# Altium project BEE-1012 PAY-EXP_V12.PrjPcb (part 2 of 4)

## Sheet 08_SAMA7G54-PMIC.SchDoc
size 420 x 297 mm; SheetNumber: 14; SheetTotal: 35
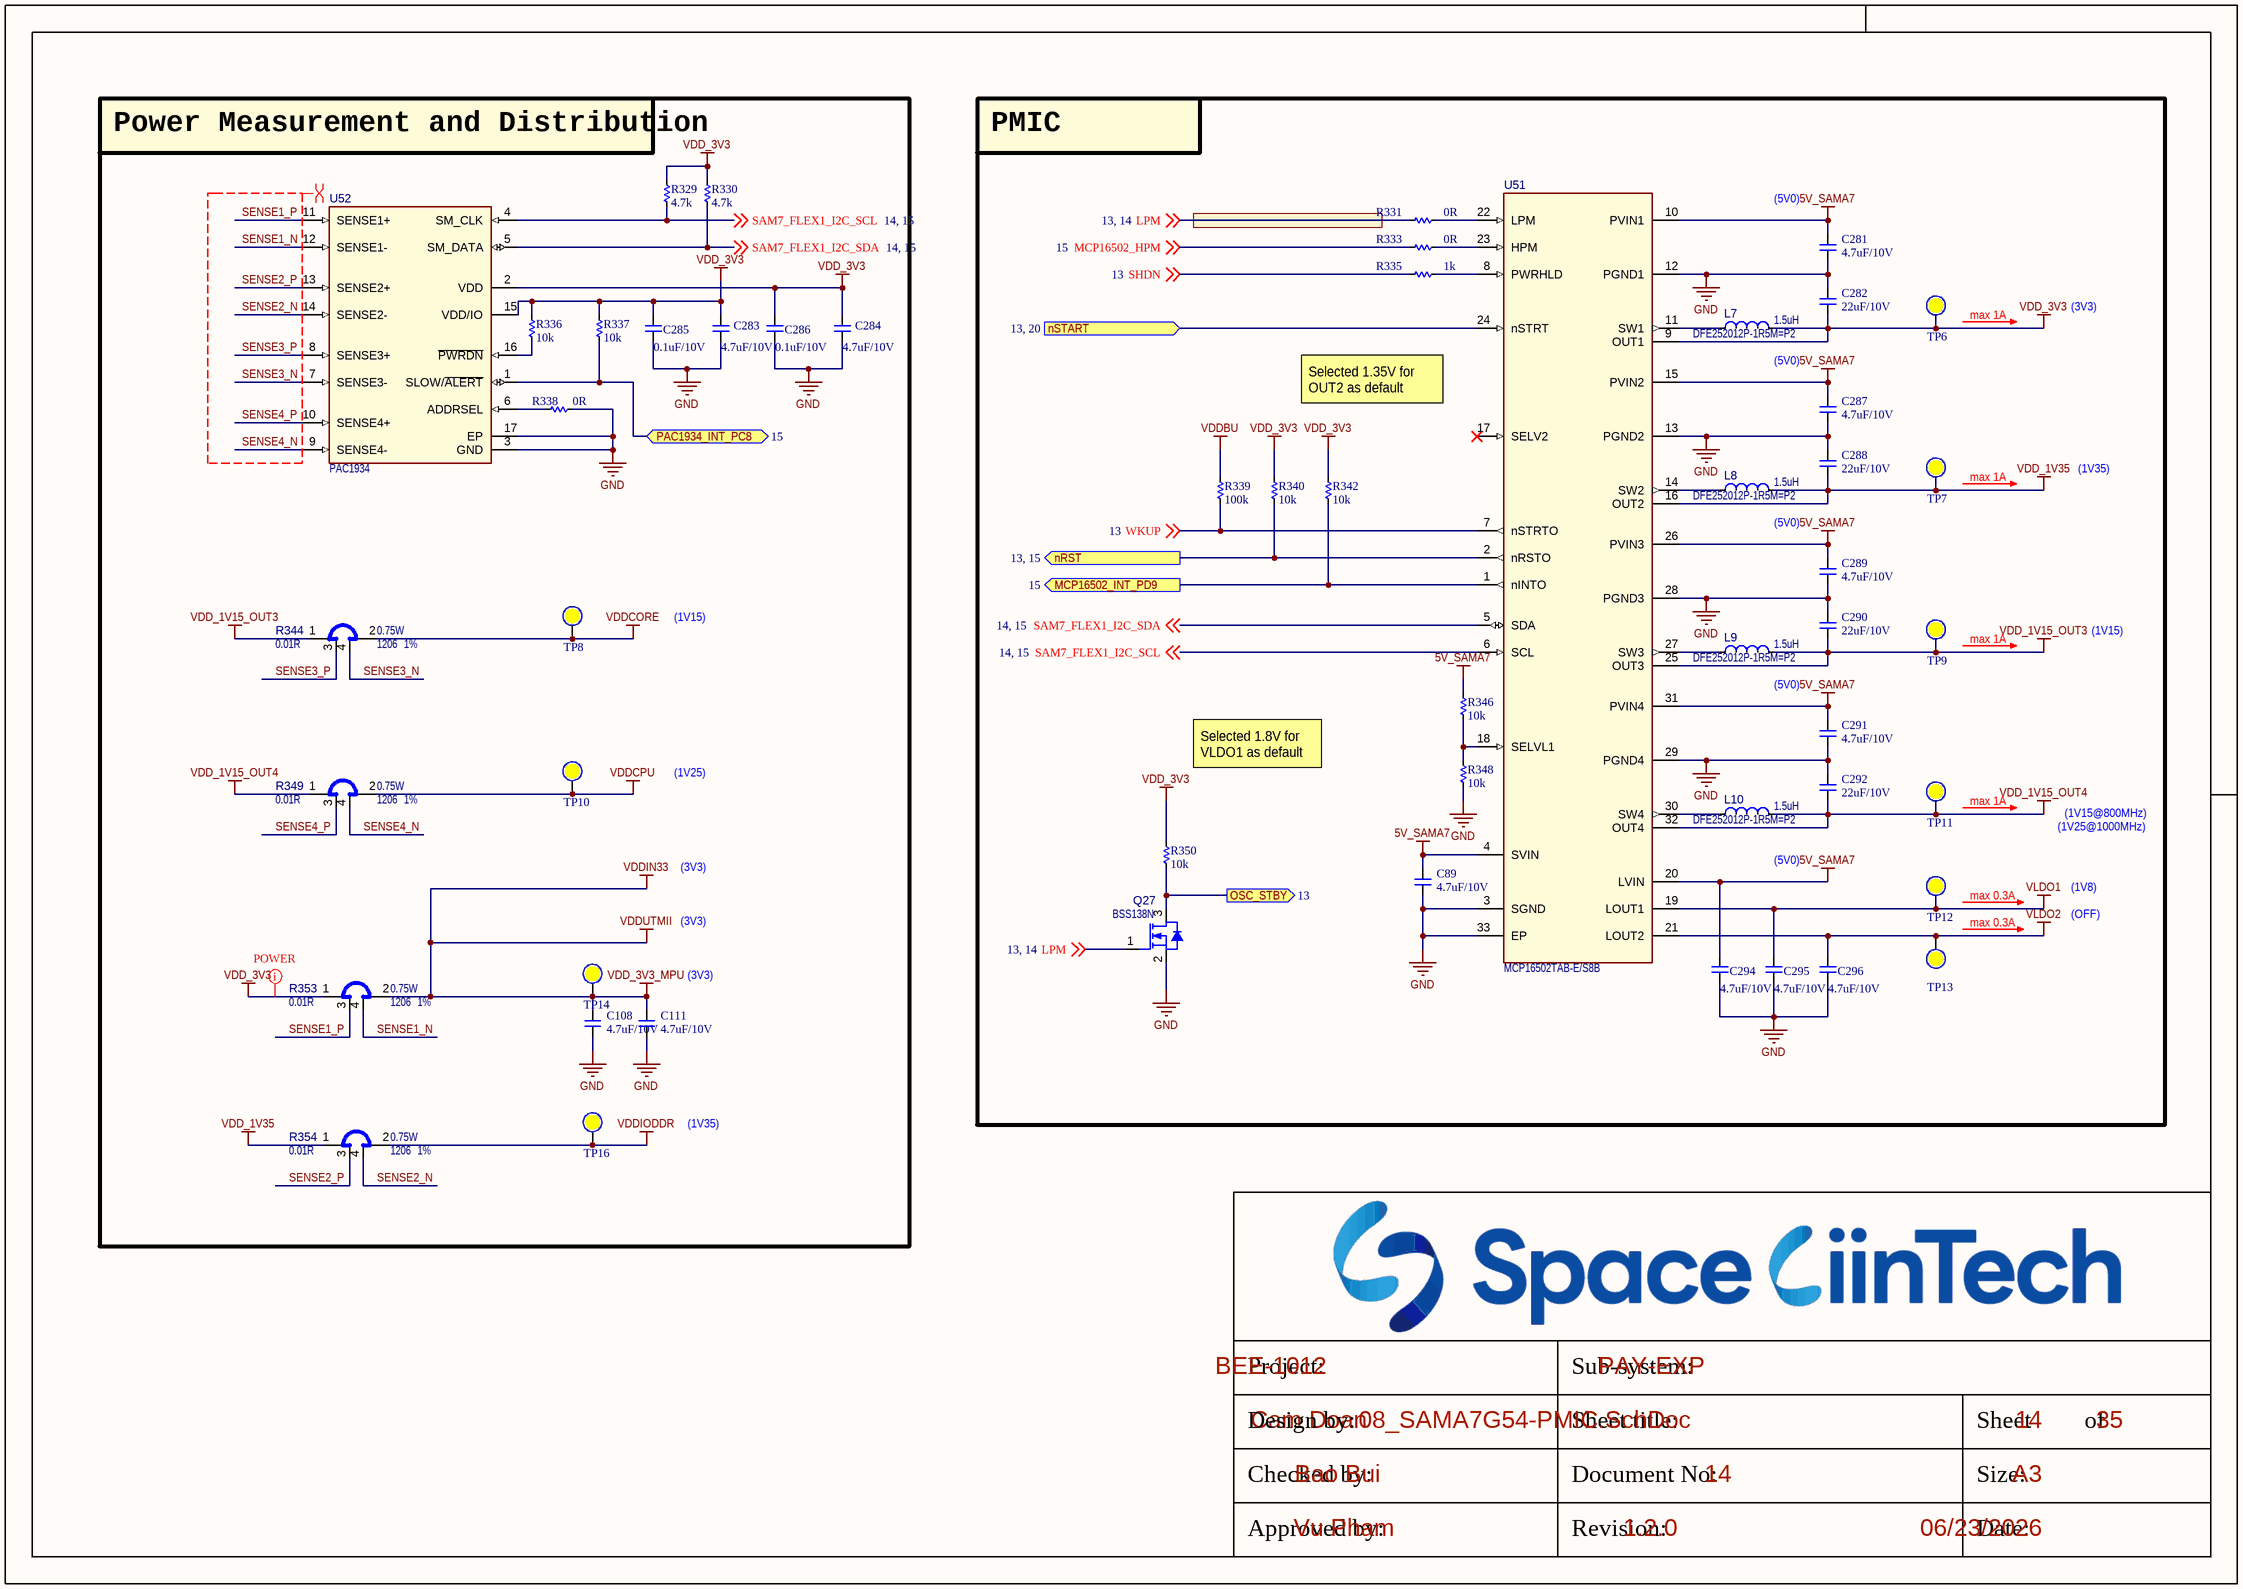
[diagram p12: 08_SAMA7G54-PMIC.SchDoc]

### Parts
C89  4.7uF/10V  [CAP_C_1005X50_L]
C108  4.7uF/10V  [CAP_C_1005X50_L]
C111  4.7uF/10V  [CAP_C_1005X50_L]
C281  4.7uF/10V  [CAP_C_1005X50_L]
C282  22uF/10V  [CAP_C_1608X80]
C283  4.7uF/10V  [CAP_C_1005X60]
C284  4.7uF/10V  [CAP_C_1005X60]
C285  0.1uF/10V  [CAP_C_1005X60]
C286  0.1uF/10V  [CAP_C_1005X60]
C287  4.7uF/10V  [CAP_C_1005X50_L]
C288  22uF/10V  [CAP_C_1608X80]
C289  4.7uF/10V  [CAP_C_1005X50_L]
C290  22uF/10V  [CAP_C_1608X80]
C291  4.7uF/10V  [CAP_C_1005X50_L]
C292  22uF/10V  [CAP_C_1608X80]
C294  4.7uF/10V  [CAP_C_1005X50_L]
C295  4.7uF/10V  [CAP_C_1005X50_L]
C296  4.7uF/10V  [CAP_C_1005X50_L]
L7  value 1.5uH  [IND_C_1008]  (hidden comment: DFE252012P-1R5M=P2)
L8  value 1.5uH  [IND_C_1008]  (hidden comment: DFE252012P-1R5M=P2)
L9  value 1.5uH  [IND_C_1008]  (hidden comment: DFE252012P-1R5M=P2)
L10  value 1.5uH  [IND_C_1008]  (hidden comment: DFE252012P-1R5M=P2)
Q27  value BSS138N  [SOT-23-3]  (hidden comment: BSS138NH6327XTSA2)
R329  4.7k  [RES_C_1005X40]
R330  4.7k  [RES_C_1005X40]
R331  0R  [RES_C_1608X60]
R333  0R  [RES_C_1608X60]
R335  1k  [RES_C_1005X40]
R336  10k  [RES_C_1005X40]
R337  10k  [RES_C_1005X40]
R338  0R  [RES_C_1005X40]
R339  100k  [RES_C_1005X40]
R340  10k  [RES_C_1005X40]
R342  10k  [RES_C_1005X40]
R344  value 0.01R  Package: 1206  Tolerance: 1%  Power: 0.75W  [RES_C_1206_SHUNT]  (hidden comment: KRL1632E-M-R010-F-T5)
R346  10k  [RES_C_1005X40]
R348  10k  [RES_C_1005X40]
R349  value 0.01R  Package: 1206  Tolerance: 1%  Power: 0.75W  [RES_C_1206_SHUNT]  (hidden comment: KRL1632E-M-R010-F-T5)
R350  10k  [RES_C_1005X40]
R353  value 0.01R  Package: 1206  Tolerance: 1%  Power: 0.75W  [RES_C_1206_SHUNT]  (hidden comment: KRL1632E-M-R010-F-T5)
R354  value 0.01R  Package: 1206  Tolerance: 1%  Power: 0.75W  [RES_C_1206_SHUNT]  (hidden comment: KRL1632E-M-R010-F-T5)
TP6  (no value)  [Testpoint_80]  (no BOM)
TP7  (no value)  [Testpoint_80]  (no BOM)
TP8  (no value)  [Testpoint_80]  (no BOM)
TP9  (no value)  [Testpoint_80]  (no BOM)
TP10  (no value)  [Testpoint_80]  (no BOM)
TP11  (no value)  [Testpoint_80]  (no BOM)
TP12  (no value)  [Testpoint_80]  (no BOM)
TP13  (no value)  [Testpoint_80]  (no BOM)
TP14  (no value)  [Testpoint_80]  (no BOM)
TP16  (no value)  [Testpoint_80]  (no BOM)
U51  value MCP16502TAB-E/S8B  [QFN-32_5X5_EP3.7X3.7]  (hidden comment: MCP16502 QFN-32)
U52  value PAC1934  [UQFN-16_4X4_EP2.6X2.6]  (hidden comment: PAC1934 UQFN-16)

### Blocks framed on the sheet
Power Measurement and Distribution: C108 C111 C283-C286 R329 R330 R336-R338 R344 R349 R353 R354 TP8 TP10 TP14 TP16 U52
PMIC: C89 C281 C282 C287-C292 C294-C296 L7-L10 Q27 R331 R333 R335 R339 R340 R342 R346 R348 R350 TP6 TP7 TP9 TP11-TP13 U51

### Ports
MCP16502_INT_PD9 (out, see 15), nRST (out, see 13, 15), nSTART (in, see 13, 20), OSC_STBY (out, see 13), PAC1934_INT_PC8 (bidir, see 15)

### Nets
5V_SAMA7: C89.1 C281.1 C287.1 C289.1 C291.1 C294.1 R346.1 U51.4(SVIN) U51.10(PVIN1) U51.15(PVIN2) U51.20(LVIN) U51.26(PVIN3) U51.31(PVIN4)
GND: C89.2 C108.2 C111.2 C281.2 C282.1 C283.2 C284.2 C285.2 C286.2 C287.2 C288.1 C289.2 C290.1 C291.2 C292.1 C294.2 C295.2 C296.2 Q27.2(S) R338.2 R348.2 U51.3(SGND) U51.12(PGND1) U51.13(PGND2) U51.28(PGND3) U51.29(PGND4) U51.33(EP) U52.3(GND) U52.17(EP)
VDD_1V15_OUT3: C290.2 L9.2(F) R344.1 TP9.1 U51.25(OUT3)
VDD_1V15_OUT4: C292.2 L10.2(F) R349.1 TP11.1 U51.32(OUT4)
VDD_1V35: C288.2 L8.2(F) R354.1 TP7.1 U51.16(OUT2)
VDD_3V3: C282.2 C283.1 C284.1 C285.1 C286.1 L7.2(F) R329.1 R330.1 R336.1 R337.1 R340.2 R342.2 R350.1 R353.1 TP6.1 U51.9(OUT1) U52.2(VDD) U52.15(VDD/IO)
VDD_3V3_MPU: C108.1 C111.1 R339.2 R353.2 TP14.1  [also labelled VDDBU, VDDIN33, VDDUTMII]
VDDCORE: R344.2 TP8.1
VDDCPU: R349.2 TP10.1
VDDIODDR: R354.2 TP16.1
VLDO1: C295.1 TP12.1 U51.19(LOUT1)
VLDO2: C296.1 TP13.1 U51.21(LOUT2)
CPU_WD_nRESET: R340.1 U51.2(nRSTO) ; port nRST
LPM: Q27.1(G) R331.1 ; off-sheet LPM
MCP16502_HPM: R333.1 ; off-sheet MCP16502_HPM
SAM7_FLEX1_I2C_SCL: R329.2 U51.6(SCL) U52.4(SM_CLK) ; off-sheet SAM7_FLEX1_I2C_SCL
SAM7_FLEX1_I2C_SDA: R330.2 U51.5(SDA) U52.5(SM_DATA) ; off-sheet SAM7_FLEX1_I2C_SDA
SENSE1_N: R353.4 U52.12(SENSE1-)
SENSE1_P: R353.3 U52.11(SENSE1+)
SENSE2_N: R354.4 U52.14(SENSE2-)
SENSE2_P: R354.3 U52.13(SENSE2+)
SENSE3_N: R344.4 U52.7(SENSE3-)
SENSE3_P: R344.3 U52.8(SENSE3+)
SENSE4_N: R349.4 U52.9(SENSE4-)
SENSE4_P: R349.3 U52.10(SENSE4+)
SHDN: R335.1 ; off-sheet SHDN
WKUP: R339.1 U51.7(nSTRTO) ; off-sheet WKUP
NetC355_1: U51.24(nSTRT) ; port nSTART
NetL7_1: L7.1(S) U51.11(SW1)
NetL8_1: L8.1(S) U51.14(SW2)
NetL9_1: L9.1(S) U51.27(SW3)
NetL10_1: L10.1(S) U51.30(SW4)
NetQ27_3: Q27.3(D) R350.2 ; port OSC_STBY
NetR331_2: R331.2 U51.22(LPM)
NetR333_2: R333.2 U51.23(HPM)
NetR335_2: R335.2 U51.8(PWRHLD)
NetR336_2: R336.2 U52.16(~{PWRDN})
NetR337_2: R337.2 U52.1(SLOW/~{ALERT}) ; port PAC1934_INT_PC8
NetR338_1: R338.1 U52.6(ADDRSEL)
NetR342_1: R342.1 U51.1(nINTO) ; port MCP16502_INT_PD9
NetR346_2: R346.2 R348.1 U51.18(SELVL1)

Not connected (* = marked no-connect by the designer): U51 17(SELV2)*

### Layout directives
differential pair: SENSE1_N, SENSE1_P, SENSE2_N, SENSE2_P, SENSE3_N, SENSE3_P, SENSE4_N, SENSE4_P
net class POWER: VDD_3V3

### Notes on the sheet
- (near C281) (5V0)
- (near TP6) max 1A
- (3V3)
- Selected 1.35V for OUT2 as default
- (5V0)
- (near TP7) max 1A
- (1V35)
- (1V15)
- (near TP9) max 1A
- (1V25)
- Selected 1.8V for VLDO1 as default
- (near TP11) max 1A
- (near L10) (5V0)
- (1V25@1000MHz)
- (1V15@800MHz)
- (near TP12) max 0.3A
- max 0.3A
- (1V8)
- (OFF)
- Project:
- Sub-system:
- Design by:
- Sheet title:
- Sheet
- of
- Checked by:
- Approved by:
- Revision:
- Document No:
- Size:
- Date:
- A3

### Library data of the parts
C89 C108 C111 C281-C292 C294-C296 = _CAP_C_2: CAP
L7-L10 = IND1335: Inductor; Manufacturer 1: Murata Electronics North America; Description_: INDUCTOR 1.5uH 3.5A 20% SMD 1008; Dev Tools Status: Design; Owner: Razvan Cristescu; DCR: 0.06R; RMS Current: 3.5A; Test Frequency: 1MHz; Populated: YES; MCHP-ID: IND1335; Revision: A; Symbol: Inductor; Status: MCL Design; ComponentLink1URL: https://chn-vm-apps.microchip.com/mchprepo/parts/Datasheets/m_dfe252012p.pdf; ComponentLink1Description: SVN Datasheet; ComponentLink2URL: C:\ALTIUM_WORK\00001_MCHP-CDB\Datasheets\m_dfe252012p.pdf; ComponentLink2Description: Local Datasheet; ComponentLink3URL: C:\ALTIUM_WORK\00001_MCHP-CDB\Library\LibraryRefs\Inductor.SchLib; ComponentLink3Description: Open Symbol; ComponentLink4URL: C:\ALTIUM_WORK\00001_MCHP-CDB\Library\Footprints\IND_C_1008.PcbLib; ComponentLink4Description: Open Footprint; ComponentLink5Description: Open Footprint 2; ComponentLink6Description: Open Footprint 3; ComponentLink7Description: Open Footprint 4; Package: 1008; Type: Inductor; Category: Inductor; Manufacturer Part Number 1: DFE252012P-1R5M=P2; Supplier 1: Digi-Key; Supplier Part Number 1: 490-10648-6-ND; Quantity Override: 1
Q27 = TRA1223: Transistor MOS; Manufacturer 1: Infineon Technologies; Description_: TRANS FET N-CH BSS138N 60V 230mA SOT23-3; Dev Tools Status: Production; Type: FET; Current: 230mA; Drain to Source Voltage: 60V; Gate to Source Voltage: 20V; Power: 0.36W; Owner: Dragos Danaila; Populated: YES; MCHP-ID: TRA1223; Revision: 1; Symbol: Transistor MOS-N GSD; Status: MCL Design; Package: SOT23-3; ComponentLink1URL: https://chn-vm-apps.microchip.com/mchprepo/parts/Datasheets/Infineon-BSS138N-DS-v02_86-en.pdf; ComponentLink1Description: SVN Datasheet; ComponentLink2URL: C:\ALTIUM_WORK\00001_MCHP-CDB\Datasheets\Infineon-BSS138N-DS-v02_86-en.pdf; ComponentLink2Description: Local Datasheet; ComponentLink3URL: C:\ALTIUM_WORK\00001_MCHP-CDB\Library\LibraryRefs\Transistor MOS-N GSD.SchLib; ComponentLink3Description: Open Symbol; ComponentLink4URL: C:\ALTIUM_WORK\00001_MCHP-CDB\Library\Footprints\SOT-23-3.PcbLib; ComponentLink4Description: Open Footprint; ComponentLink5Description: Open Footprint 2; ComponentLink6Description: Open Footprint 3; ComponentLink7Description: Open Footprint 4; Operating Temperature: -55C to +150C; Category: Transistor; Voltage: 60V; Manufacturer Part Number 1: BSS138NH6327XTSA2; Supplier 1: Digi-Key; Supplier Part Number 1: BSS138NH6327XTSA2CT-ND; Quantity Override: 1
R329-R331 R333 R335-R340 R342 R346 R348 R350 = _RES_B_2: RES
R344 R349 R353 R354 = RSMT1316: Shunt; Manufacturer 1: SUSUMU; Description_: RES SHUNT MF 0.01R 1% 0.75W SMD 1206; Dev Tools Status: Design; Temperature Coeffcient: 50ppm/C; Current: 8A; Owner: Ciprian Abramov; Populated: YES; MCHP-ID: RSMT1316; Revision: 1; Symbol: Shunt 4 Pin; Status: MCL Design; ComponentLink1URL: https://chn-vm-apps.microchip.com/mchprepo/parts/Datasheets/n_catalog_partition09_en.pdf; ComponentLink1Description: SVN Datasheet; ComponentLink2URL: C:\ALTIUM_WORK\00001_MCHP-CDB\Datasheets\n_catalog_partition09_en.pdf; ComponentLink2Description: Local Datasheet; ComponentLink3URL: C:\ALTIUM_WORK\00001_MCHP-CDB\Library\LibraryRefs\Shunt 4 Pin.SchLib; ComponentLink3Description: Open Symbol; ComponentLink4URL: C:\ALTIUM_WORK\00001_MCHP-CDB\Library\Footprints\RES_C_1206_SHUNT.PcbLib; ComponentLink4Description: Open Footprint; ComponentLink5Description: Open Footprint 2; ComponentLink6Description: Open Footprint 3; ComponentLink7Description: Open Footprint 4; Operating Temperature: -55C to +155C; Category: Resistor; Type: RES SMD; Composition: MF; Manufacturer Part Number 1: KRL1632E-M-R010-F-T5; Supplier 1: Digi-Key; Supplier Part Number 1: 408-1570-1-ND; Quantity Override: 1
TP6-TP14 TP16 = Test Point: Solder: NF
U51 = MIC8878: Manufacturer 1: Microchip Technology; Populated: YES; Description_: MCHP ANALOG PMIC SWITCHER Buck ADJ MCP16502TAB-E/S8B QFN-32 for SAMA7G5 MPU with LPDDR/DDR2/DDR3; Dev Tools Status: Design; Owner: Dragos Danaila; MCHP-ID: MIC8878; Symbol: MCP16502 QFN-32; Type: Switcher; Status: MCL Design; Revision: 1; Category: MCHP-Analog; ComponentLink1Description: SVN Datasheet; ComponentLink2Description: Local Datasheet; ComponentLink3URL: C:\ALTIUM_WORK\00001_MCHP-CDB\Library\LibraryRefs\MCP16502 QFN-32.SchLib; ComponentLink3Description: Open Symbol; ComponentLink4URL: C:\ALTIUM_WORK\00001_MCHP-CDB\Library\Footprints\QFN-32_5X5_EP3.7X3.7.PcbLib; ComponentLink4Description: Open Footprint; ComponentLink5Description: Open Footprint 2; ComponentLink6Description: Open Footprint 3; ComponentLink7Description: Open Footprint 4; Manufacturer Part Number 1: MCP16502TAB-E/S8B; Supplier 1: Digi-Key; Supplier Part Number 1: 150-MCP16502TAB-E/S8BCT-ND; Quantity Override: 1; ComponentLink2URL: C:\ALTIUM_WORK\00001_MCHP-CDB\Datasheets\MCP16502-High-Performance-PMIC-for-SAMA5DX-SAM9X6-MPUs-Data-Sheet-DS20006275B.pdf
U52 = MIC8883: Manufacturer 1: Microchip Technology; Manufacturer Part Number 1: PAC1934T-I/JQ; Description_: MCHP ANALOG POWER CURRENT SENSE MONITOR PAC1934T-I/JQ UQFN-16; Dev Tools Status: Design; Owner: Ciprian Abramov; Populated: YES; MCHP-ID: MIC8883; Symbol: PAC1934 UQFN-16; Type: Power/Current Sensor; Status: MCL Design; Revision: 1; Category: MCHP-Analog; ComponentLink1Description: SVN Datasheet; ComponentLink2Description: Local Datasheet; ComponentLink3URL: C:\ALTIUM_WORK\00001_MCHP-CDB\Library\LibraryRefs\PAC1934 UQFN-16.SchLib; ComponentLink3Description: Open Symbol; ComponentLink4URL: C:\ALTIUM_WORK\00001_MCHP-CDB\Library\Footprints\UQFN-16_4X4_EP2.6X2.6.PcbLib; ComponentLink4Description: Open Footprint; ComponentLink5Description: Open Footprint 2; ComponentLink6Description: Open Footprint 3; ComponentLink7Description: Open Footprint 4; Supplier 1: Digi-Key; Supplier Part Number 1: PAC1934T-I/JQCT-ND; Quantity Override: 1

## Sheet 08_SAMA7G54-PIO.SchDoc
size 420 x 297 mm; SheetNumber: 15; SheetTotal: 36
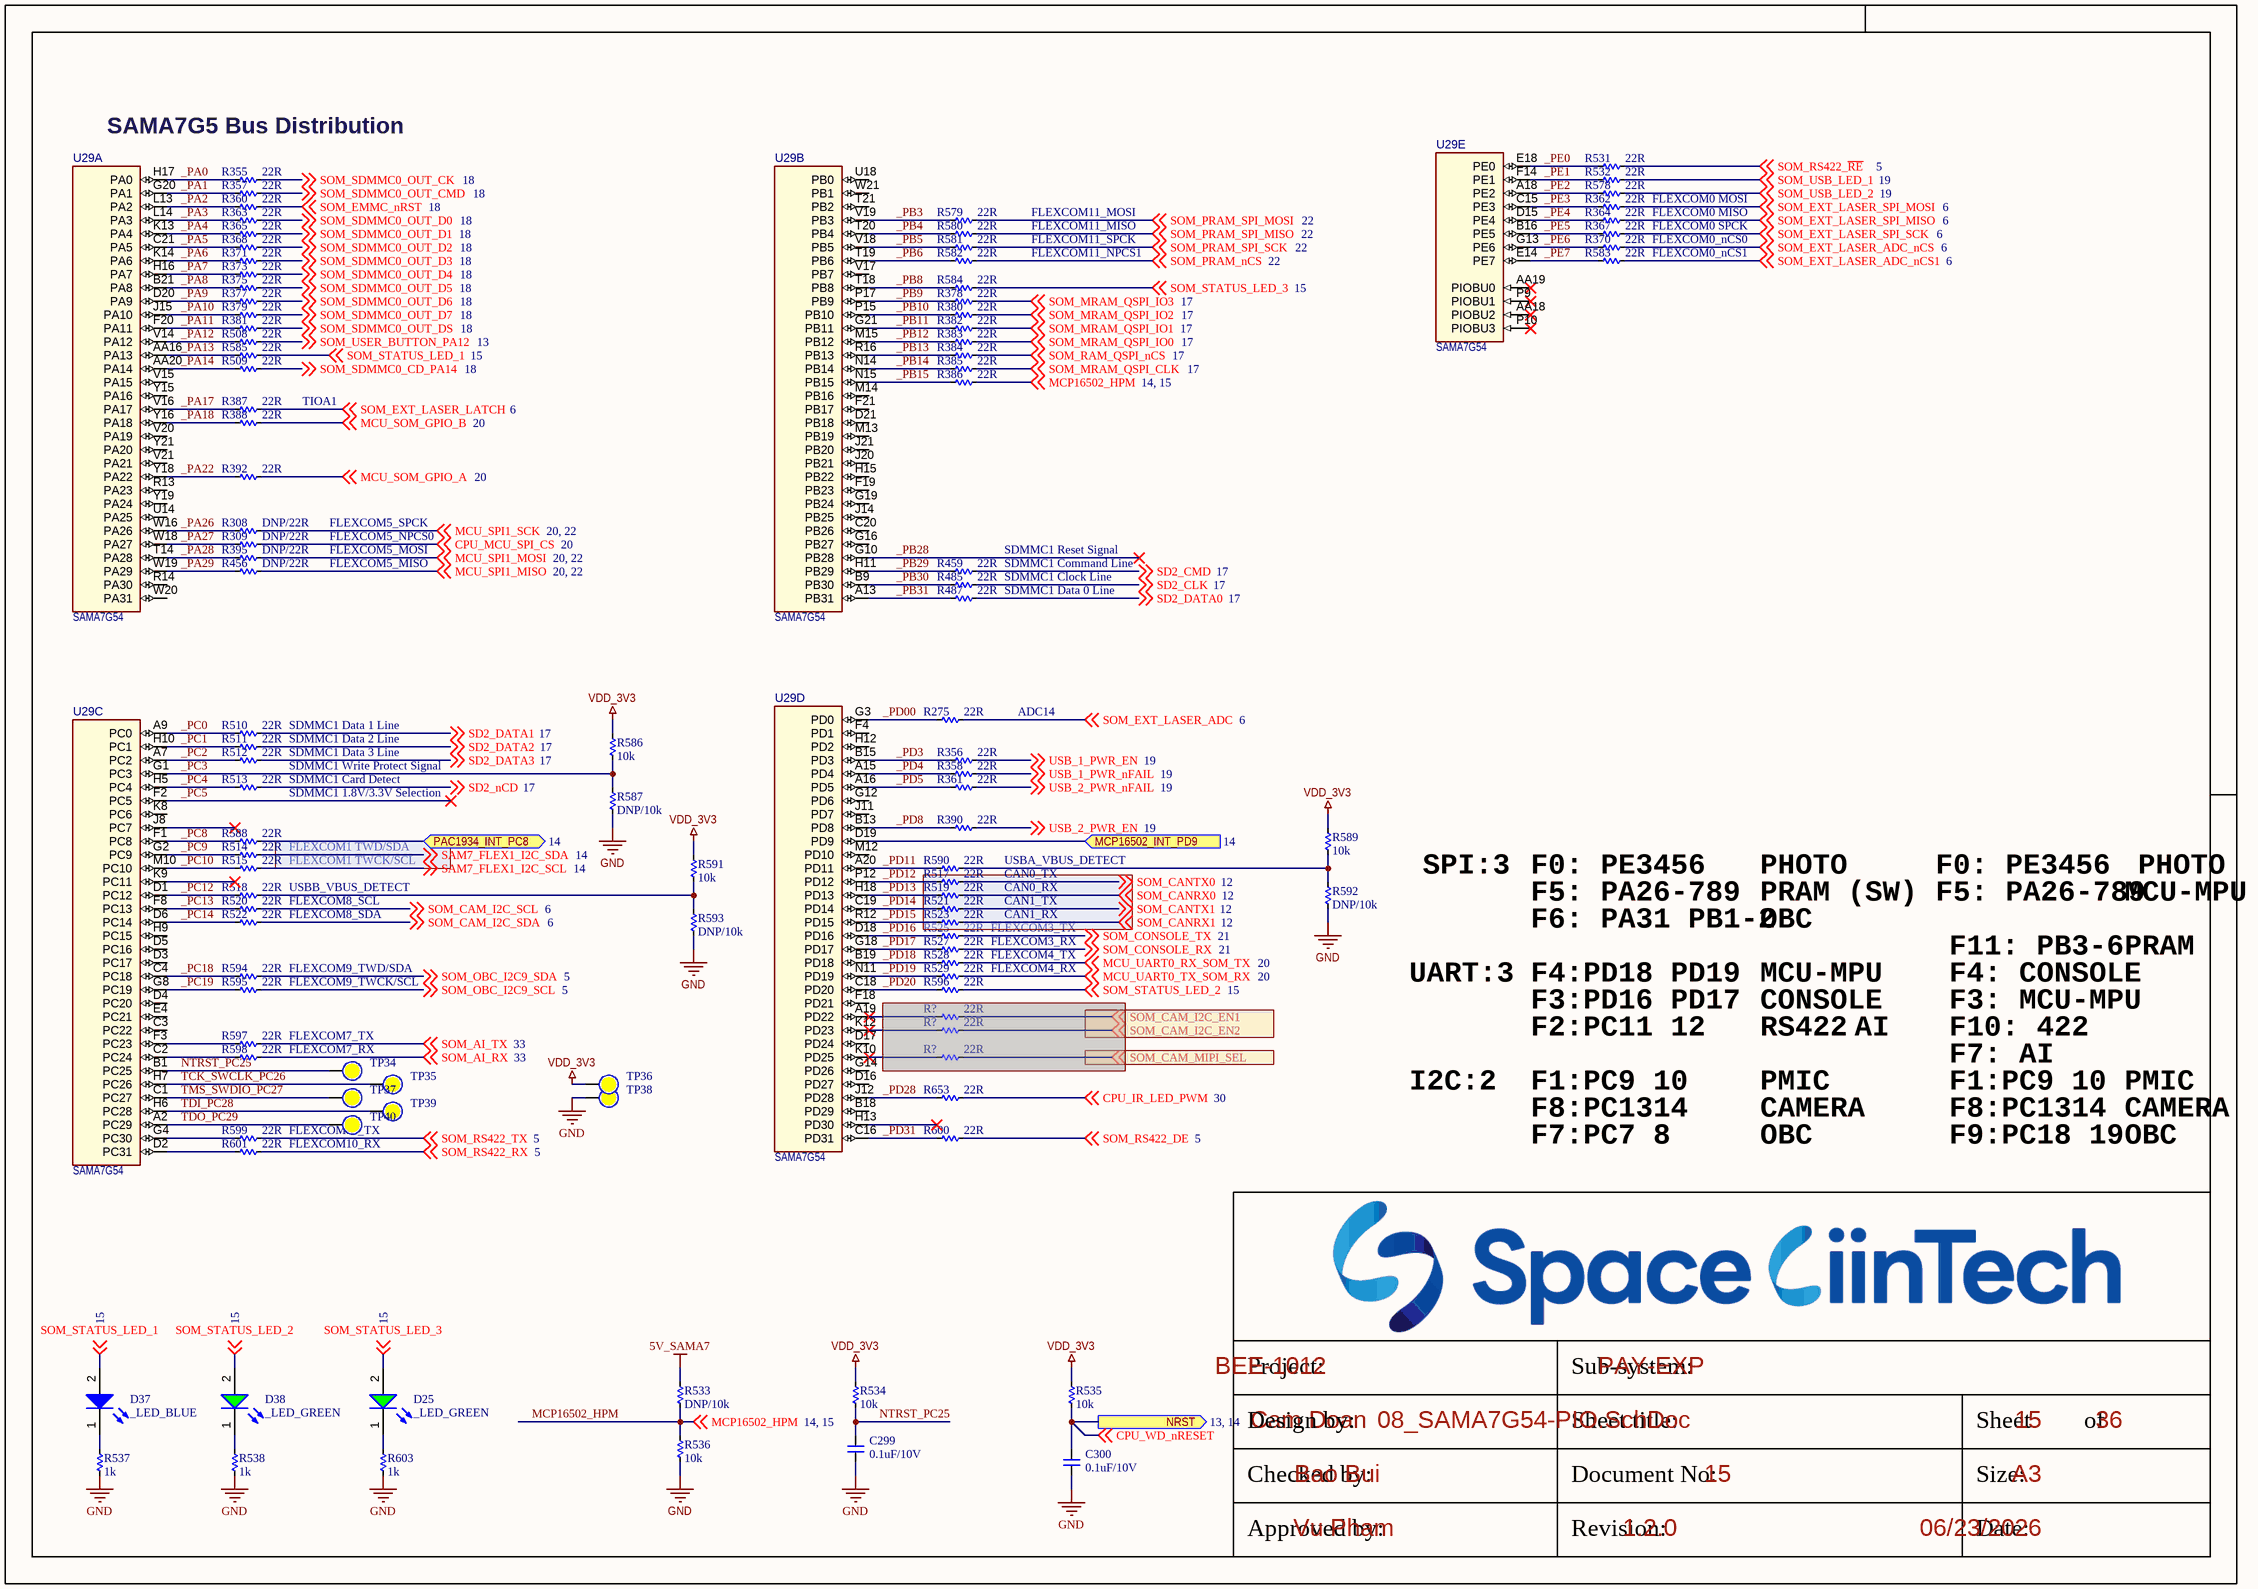
[diagram p13: 08_SAMA7G54-PIO.SchDoc]

### Parts
(Parts that share a designator on the sheet are numbered #1, #2 ... from top to bottom, then left to right.)
C299  0.1uF/10V  [CAP_C_1005X60]
C300  0.1uF/10V  [CAP_C_1005X60]
D25  _LED_GREEN  [LED_0603]
D37  _LED_BLUE  [LED_0603]
D38  _LED_GREEN  [LED_0603]
R275  22R  [RES_C_1005X40]
R308  DNP/22R  [RES_C_1005X40]
R309  DNP/22R  [RES_C_1005X40]
R355  22R  [RES_C_1005X40]
R356  22R  [RES_C_1005X40]
R357  22R  [RES_C_1005X40]
R358  22R  [RES_C_1005X40]
R360  22R  [RES_C_1005X40]
R361  22R  [RES_C_1005X40]
R362  22R  [RES_C_1005X40]
R363  22R  [RES_C_1005X40]
R364  22R  [RES_C_1005X40]
R365  22R  [RES_C_1005X40]
R367  22R  [RES_C_1005X40]
R368  22R  [RES_C_1005X40]
R370  22R  [RES_C_1005X40]
R371  22R  [RES_C_1005X40]
R373  22R  [RES_C_1005X40]
R375  22R  [RES_C_1005X40]
R377  22R  [RES_C_1005X40]
R378  22R  [RES_C_1005X40]
R379  22R  [RES_C_1005X40]
R380  22R  [RES_C_1005X40]
R381  22R  [RES_C_1005X40]
R382  22R  [RES_C_1005X40]
R383  22R  [RES_C_1005X40]
R384  22R  [RES_C_1005X40]
R385  22R  [RES_C_1005X40]
R386  22R  [RES_C_1005X40]
R387  22R  [RES_C_1005X40]
R388  22R  [RES_C_1005X40]
R390  22R  [RES_C_1005X40]
R392  22R  [RES_C_1005X40]
R395  DNP/22R  [RES_C_1005X40]
R456  DNP/22R  [RES_C_1005X40]
R459  22R  [RES_C_1005X40]
R485  22R  [RES_C_1005X40]
R487  22R  [RES_C_1005X40]
R508  22R  [RES_C_1005X40]
R509  22R  [RES_C_1005X40]
R510  22R  [RES_C_1005X40]
R511  22R  [RES_C_1005X40]
R512  22R  [RES_C_1005X40]
R513  22R  [RES_C_1005X40]
R514  22R  [RES_C_1005X40]
R515  22R  [RES_C_1005X40]
R517  22R  [RES_C_1005X40]
R518  22R  [RES_C_1005X40]
R519  22R  [RES_C_1005X40]
R520  22R  [RES_C_1005X40]
R521  22R  [RES_C_1005X40]
R522  22R  [RES_C_1005X40]
R523  22R  [RES_C_1005X40]
R525  22R  [RES_C_1005X40]
R527  22R  [RES_C_1005X40]
R528  22R  [RES_C_1005X40]
R529  22R  [RES_C_1005X40]
R531  22R  [RES_C_1005X40]
R532  22R  [RES_C_1005X40]
R533  DNP/10k  [RES_C_1005X40]
R534  10k  [RES_C_1005X40]
R535  10k  [RES_C_1005X40]
R536  10k  [RES_C_1005X40]
R537  1k  [RES_C_1005X40]
R538  1k  [RES_C_1005X40]
R578  22R  [RES_C_1005X40]
R579  22R  [RES_C_1005X40]
R580  22R  [RES_C_1005X40]
R581  22R  [RES_C_1005X40]
R582  22R  [RES_C_1005X40]
R583  22R  [RES_C_1005X40]
R584  22R  [RES_C_1005X40]
R585  22R  [RES_C_1005X40]
R586  10k  [RES_C_1005X40]
R587  DNP/10k  [RES_C_1005X40]
R588  22R  [RES_C_1005X40]
R589  10k  [RES_C_1005X40]
R590  22R  [RES_C_1005X40]
R591  10k  [RES_C_1005X40]
R592  DNP/10k  [RES_C_1005X40]
R593  DNP/10k  [RES_C_1005X40]
R594  22R  [RES_C_1005X40]
R595  22R  [RES_C_1005X40]
R596  22R  [RES_C_1005X40]
R597  22R  [RES_C_1005X40]
R598  22R  [RES_C_1005X40]
R599  22R  [RES_C_1005X40]
R600  22R  [RES_C_1005X40]
R601  22R  [RES_C_1005X40]
R603  1k  [RES_C_1005X40]
R653  22R  [RES_C_1005X40]
R?#1  22R  [RES_C_1005X40]  (masked out: inside a compile mask, not in the netlist)
R?#2  22R  [RES_C_1005X40]  (masked out: inside a compile mask, not in the netlist)
R?#3  22R  [RES_C_1005X40]  (masked out: inside a compile mask, not in the netlist)
TP34  (no value)  [Testpoint_TH_D130H80]  (no BOM)
TP35  (no value)  [Testpoint_TH_D130H80]  (no BOM)
TP36  (no value)  [Testpoint_TH_D130H80]  (no BOM)
TP37  (no value)  [Testpoint_TH_D130H80]  (no BOM)
TP38  (no value)  [Testpoint_TH_D130H80]  (no BOM)
TP39  (no value)  [Testpoint_TH_D130H80]  (no BOM)
TP40  (no value)  [Testpoint_TH_D130H80]  (no BOM)
U29  SAMA7G54  [TFBGA-343_14x14 - 2.5mm]  (parts A,B,C,D,E of 8)

### Ports
MCP16502_INT_PD9 (in, see 14), NRST (out, see 13, 14), PAC1934_INT_PC8 (bidir, see 14)

### Nets
5V_SAMA7: R533.1
GND: C299.1 C300.1 R536.2 R537.2 R538.2 R587.2 R592.2 R593.2 R603.2 TP38.1
VDD_3V3: R534.2 R535.2 R586.1 R589.1 R591.1 TP36.1
_PA0: R355.2 U29.H17(PA0)
_PA1: R357.2 U29.G20(PA1)
_PA2: R360.2 U29.L13(PA2)
_PA3: R363.2 U29.L14(PA3)
_PA4: R365.2 U29.K13(PA4)
_PA5: R368.2 U29.C21(PA5)
_PA6: R371.2 U29.K14(PA6)
_PA7: R373.2 U29.H16(PA7)
_PA8: R375.2 U29.B21(PA8)
_PA9: R377.2 U29.D20(PA9)
_PA10: R379.2 U29.J15(PA10)
_PA11: R381.2 U29.F20(PA11)
_PA12: R508.2 U29.V14(PA12)
_PA13: R585.2 U29.AA16(PA13)
_PA14: R509.2 U29.AA20(PA14)
_PA17: R387.2 U29.V16(PA17)
_PA18: R388.2 U29.Y16(PA18)
_PA22: R392.2 U29.Y18(PA22)
_PA26: R308.2 U29.W16(PA26)
_PA27: R309.2 U29.W18(PA27)
_PA28: R395.2 U29.T14(PA28)
_PA29: R456.2 U29.W19(PA29)
_PB3: R579.2 U29.V19(PB3)
_PB4: R580.2 U29.T20(PB4)
_PB5: R581.2 U29.V18(PB5)
_PB6: R582.2 U29.T19(PB6)
_PB8: R584.2 U29.T18(PB8)
_PB9: R378.2 U29.P17(PB9)
_PB10: R380.2 U29.P15(PB10)
_PB11: R382.2 U29.G21(PB11)
_PB12: R383.2 U29.M15(PB12)
_PB13: R384.2 U29.R16(PB13)
_PB14: R385.2 U29.N14(PB14)
_PB15: R386.2 U29.N15(PB15)
_PB28: U29.G10(PB28)
_PB29: R459.2 U29.H11(PB29)
_PB30: R485.2 U29.B9(PB30)
_PB31: R487.2 U29.A13(PB31)
_PC0: R510.2 U29.A9(PC0)
_PC1: R511.2 U29.H10(PC1)
_PC2: R512.2 U29.A7(PC2)
_PC3: R586.2 R587.1 U29.G1(PC3)
_PC4: R513.2 U29.H5(PC4)
_PC5: U29.F2(PC5)
_PC8: R588.2 U29.F1(PC8)
_PC9: R514.2 U29.G2(PC9)
_PC10: R515.2 U29.M10(PC10)
_PC12: R518.2 U29.D1(PC12)
_PC13: R520.2 U29.F8(PC13)
_PC14: R522.2 U29.D6(PC14)
_PC18: R594.2 U29.C4(PC18)
_PC19: R595.2 U29.G8(PC19)
_PD00: R275.2 U29.G3(PD0)
_PD3: R356.2 U29.B15(PD3)
_PD4: R358.2 U29.A15(PD4)
_PD5: R361.2 U29.A16(PD5)
_PD8: R390.2 U29.B13(PD8)
_PD11: R590.2 U29.A20(PD11)
_PD12: R517.2 U29.P12(PD12)
_PD13: R519.2 U29.H18(PD13)
_PD14: R521.2 U29.C19(PD14)
_PD15: R523.2 U29.R12(PD15)
_PD16: R525.2 U29.D18(PD16)
_PD17: R527.2 U29.G18(PD17)
_PD18: R528.2 U29.B19(PD18)
_PD19: R529.2 U29.N11(PD19)
_PD20: R596.2 U29.C18(PD20)
_PD28: R653.2 U29.J12(PD28)
_PD31: R600.2 U29.C16(PD31)
_PE0: R531.2 U29.E18(PE0)
_PE1: R532.2 U29.F14(PE1)
_PE2: R578.2 U29.A18(PE2)
_PE3: R362.2 U29.C15(PE3)
_PE4: R364.2 U29.D15(PE4)
_PE5: R367.2 U29.B16(PE5)
_PE6: R370.2 U29.G13(PE6)
_PE7: R583.2 U29.E14(PE7)
CPU_IR_LED_PWM: R653.1 ; off-sheet CPU_IR_LED_PWM
CPU_MCU_SPI_CS: R309.1 ; off-sheet CPU_MCU_SPI_CS
CPU_WD_nRESET: C300.2 R535.1 ; off-sheet CPU_WD_nRESET, port NRST
MCP16502_HPM: R386.1 R533.2 R536.1 ; off-sheet MCP16502_HPM
MCU_SOM_GPIO_A: R392.1 ; off-sheet MCU_SOM_GPIO_A
MCU_SOM_GPIO_B: R388.1 ; off-sheet MCU_SOM_GPIO_B
MCU_SPI1_MISO: R456.1 ; off-sheet MCU_SPI1_MISO
MCU_SPI1_MOSI: R395.1 ; off-sheet MCU_SPI1_MOSI
MCU_SPI1_SCK: R308.1 ; off-sheet MCU_SPI1_SCK
MCU_UART0_RX_SOM_TX: R528.1 ; off-sheet MCU_UART0_RX_SOM_TX
MCU_UART0_TX_SOM_RX: R529.1 ; off-sheet MCU_UART0_TX_SOM_RX
NTRST_PC25: C299.2 R534.1 TP34.1 U29.B1(PC25)
SAM7_FLEX1_I2C_SCL: R515.1 ; off-sheet SAM7_FLEX1_I2C_SCL
SAM7_FLEX1_I2C_SDA: R514.1 ; off-sheet SAM7_FLEX1_I2C_SDA
SD2_CLK: R485.1 ; off-sheet SD2_CLK
SD2_CMD: R459.1 ; off-sheet SD2_CMD
SD2_DATA0: R487.1 ; off-sheet SD2_DATA0
SD2_DATA1: R510.1 ; off-sheet SD2_DATA1
SD2_DATA2: R511.1 ; off-sheet SD2_DATA2
SD2_DATA3: R512.1 ; off-sheet SD2_DATA3
SD2_nCD: R513.1 ; off-sheet SD2_nCD
SOM_AI_RX: R598.1 ; off-sheet SOM_AI_RX
SOM_AI_TX: R597.1 ; off-sheet SOM_AI_TX
SOM_CAM_I2C_SCL: R520.1 ; off-sheet SOM_CAM_I2C_SCL
SOM_CAM_I2C_SDA: R522.1 ; off-sheet SOM_CAM_I2C_SDA
SOM_CANRX0: R519.1 ; off-sheet SOM_CANRX0
SOM_CANRX1: R523.1 ; off-sheet SOM_CANRX1
SOM_CANTX0: R517.1 ; off-sheet SOM_CANTX0
SOM_CANTX1: R521.1 ; off-sheet SOM_CANTX1
SOM_CONSOLE_RX: R527.1 ; off-sheet SOM_CONSOLE_RX
SOM_CONSOLE_TX: R525.1 ; off-sheet SOM_CONSOLE_TX
SOM_EMMC_nRST: R360.1 ; off-sheet SOM_EMMC_nRST
SOM_EXT_LASER_ADC: R275.1 ; off-sheet SOM_EXT_LASER_ADC
SOM_EXT_LASER_ADC_nCS: R370.1 ; off-sheet SOM_EXT_LASER_ADC_nCS
SOM_EXT_LASER_ADC_nCS1: R583.1 ; off-sheet SOM_EXT_LASER_ADC_nCS1
SOM_EXT_LASER_LATCH: R387.1 ; off-sheet SOM_EXT_LASER_LATCH
SOM_EXT_LASER_SPI_MISO: R364.1 ; off-sheet SOM_EXT_LASER_SPI_MISO
SOM_EXT_LASER_SPI_MOSI: R362.1 ; off-sheet SOM_EXT_LASER_SPI_MOSI
SOM_EXT_LASER_SPI_SCK: R367.1 ; off-sheet SOM_EXT_LASER_SPI_SCK
SOM_MRAM_QSPI_CLK: R385.1 ; off-sheet SOM_MRAM_QSPI_CLK
SOM_MRAM_QSPI_IO0: R383.1 ; off-sheet SOM_MRAM_QSPI_IO0
SOM_MRAM_QSPI_IO1: R382.1 ; off-sheet SOM_MRAM_QSPI_IO1
SOM_MRAM_QSPI_IO2: R380.1 ; off-sheet SOM_MRAM_QSPI_IO2
SOM_MRAM_QSPI_IO3: R378.1 ; off-sheet SOM_MRAM_QSPI_IO3
SOM_OBC_I2C9_SCL: R595.1 ; off-sheet SOM_OBC_I2C9_SCL
SOM_OBC_I2C9_SDA: R594.1 ; off-sheet SOM_OBC_I2C9_SDA
SOM_PRAM_nCS: R582.1 ; off-sheet SOM_PRAM_nCS
SOM_PRAM_SPI_MISO: R580.1 ; off-sheet SOM_PRAM_SPI_MISO
SOM_PRAM_SPI_MOSI: R579.1 ; off-sheet SOM_PRAM_SPI_MOSI
SOM_PRAM_SPI_SCK: R581.1 ; off-sheet SOM_PRAM_SPI_SCK
SOM_RAM_QSPI_nCS: R384.1 ; off-sheet SOM_RAM_QSPI_nCS
SOM_RS422_DE: R600.1 ; off-sheet SOM_RS422_DE  [project net RS422_DE]
SOM_RS422_~{RE}: R531.1 ; off-sheet SOM_RS422_~{RE}  [project net RS422_~{RE}]
SOM_RS422_RX: R601.1 ; off-sheet SOM_RS422_RX
SOM_RS422_TX: R599.1 ; off-sheet SOM_RS422_TX
SOM_SDMMC0_CD_PA14: R509.1 ; off-sheet SOM_SDMMC0_CD_PA14
SOM_SDMMC0_OUT_CK: R355.1 ; off-sheet SOM_SDMMC0_OUT_CK
SOM_SDMMC0_OUT_CMD: R357.1 ; off-sheet SOM_SDMMC0_OUT_CMD
SOM_SDMMC0_OUT_D0: R363.1 ; off-sheet SOM_SDMMC0_OUT_D0
SOM_SDMMC0_OUT_D1: R365.1 ; off-sheet SOM_SDMMC0_OUT_D1
SOM_SDMMC0_OUT_D2: R368.1 ; off-sheet SOM_SDMMC0_OUT_D2
SOM_SDMMC0_OUT_D3: R371.1 ; off-sheet SOM_SDMMC0_OUT_D3
SOM_SDMMC0_OUT_D4: R373.1 ; off-sheet SOM_SDMMC0_OUT_D4
SOM_SDMMC0_OUT_D5: R375.1 ; off-sheet SOM_SDMMC0_OUT_D5
SOM_SDMMC0_OUT_D6: R377.1 ; off-sheet SOM_SDMMC0_OUT_D6
SOM_SDMMC0_OUT_D7: R379.1 ; off-sheet SOM_SDMMC0_OUT_D7
SOM_SDMMC0_OUT_DS: R381.1 ; off-sheet SOM_SDMMC0_OUT_DS
SOM_STATUS_LED_1: D37.2(A) R585.1 ; off-sheet SOM_STATUS_LED_1
SOM_STATUS_LED_2: D38.2(A) R596.1 ; off-sheet SOM_STATUS_LED_2
SOM_STATUS_LED_3: D25.2(A) R584.1 ; off-sheet SOM_STATUS_LED_3
SOM_USB_LED_1: R532.1 ; off-sheet SOM_USB_LED_1
SOM_USB_LED_2: R578.1 ; off-sheet SOM_USB_LED_2
SOM_USER_BUTTON_PA12: R508.1 ; off-sheet SOM_USER_BUTTON_PA12
TCK_SWCLK_PC26: TP35.1 U29.H7(PC26)
TDI_PC28: TP39.1 U29.H6(PC28)
TDO_PC29: TP40.1 U29.A2(PC29)
TMS_SWDIO_PC27: TP37.1 U29.C1(PC27)
USB_1_PWR_EN: R356.1 ; off-sheet USB_1_PWR_EN
USB_1_PWR_nFAIL: R358.1 ; off-sheet USB_1_PWR_nFAIL
USB_2_PWR_EN: R390.1 ; off-sheet USB_2_PWR_EN
USB_2_PWR_nFAIL: R361.1 ; off-sheet USB_2_PWR_nFAIL
NetD25_1: D25.1(K) R603.1
NetD37_1: D37.1(K) R537.1
NetD38_1: D38.1(K) R538.1
NetR337_2: R588.1 ; port PAC1934_INT_PC8
NetR342_1: U29.D19(PD9) ; port MCP16502_INT_PD9
NetR518_1: R518.1 R591.2 R593.1
NetR589_2: R589.2 R590.1 R592.1
NetR597_2: R597.2 U29.F3(PC23)
NetR598_2: R598.2 U29.C2(PC24)
NetR599_2: R599.2 U29.G4(PC30)
NetR601_2: R601.2 U29.D2(PC31)

Not connected (* = marked no-connect by the designer): U29 A19(PD22)* AA18(PIOBU2)* AA19(PIOBU0)* B18(PD29) C3(PC22) C20(PB26) D3(PC17) D4(PC20) D5(PC16) D16(PD27) D17(PD24) D21(PB18) E4(PC21) F4(PD1) F18(PD21) F19(PB23) F21(PB17) G12(PD6) G14(PD26) G16(PB27) G19(PB24) H9(PC15) H12(PD2) H13(PD30)* H15(PB22) J8(PC7)* J11(PD7) J14(PB25) J20(PB21) J21(PB20) K8(PC6) K9(PC11)* K10(PD25)* K12(PD23)* M12(PD10) M13(PB19) M14(PB16) P9(PIOBU1)* P10(PIOBU3)* R13(PA23) R14(PA30) T21(PB2) U14(PA25) U18(PB0) V15(PA15) V17(PB7) V20(PA19) V21(PA21) W20(PA31) W21(PB1) Y15(PA16) Y19(PA24) Y21(PA20)

### Notes on the sheet
- SAMA7G5 Bus Distribution
- FLEXCOM11_SPCK
- FLEXCOM11_NPCS1
- FLEXCOM11_MOSI
- FLEXCOM11_MISO
- FLEXCOM0 MISO
- FLEXCOM0_nCS0
- FLEXCOM0 SPCK
- FLEXCOM0 MOSI
- FLEXCOM0_nCS1
- TIOA1
- FLEXCOM5_SPCK
- FLEXCOM5_NPCS0
- FLEXCOM5_MOSI
- FLEXCOM5_MISO
- SDMMC1 Reset Signal
- SDMMC1 Command Line
- SDMMC1 Data 0 Line
- SDMMC1 Clock Line
- SDMMC1 Data 1 Line
- ADC14
- SDMMC1 Data 2 Line
- SDMMC1 Data 3 Line
- SDMMC1 Write Protect Signal
- SDMMC1 Card Detect
- SDMMC1 1.8V/3.3V Selection
- FLEXCOM1 TWD/SDA
- FLEXCOM1 TWCK/SCL
- USBA_VBUS_DETECT
- FLEXCOM8_SCL
- FLEXCOM8_SDA
- USBB_VBUS_DETECT
- FLEXCOM3_TX
- CAN0_TX
- CAN0_RX
- CAN1_TX
- CAN1_RX
- SPI:3
- F0: PE3456
- F5: PA26-789
- F6: PA31 PB1-2
- PHOTO
- PRAM (SW)
- OBC
- MCU-MPU
- FLEXCOM9_TWD/SDA
- FLEXCOM9_TWCK/SCL
- FLEXCOM3_RX
- FLEXCOM4_TX
- FLEXCOM4_RX
- UART:3
- F4:PD18 PD19
- F11: PB3-6
- F4: CONSOLE
- PRAM
- FLEXCOM7_TX
- (near TP34) FLEXCOM7_RX
- F3:PD16 PD17
- F2:PC11 12
- RS422
- CONSOLE
- AI
- F3: MCU-MPU
- F10: 422
- F7: AI
- (near TP40) FLEXCOM10_TX
- I2C:2
- F1:PC9 10
- F8:PC1314
- PMIC
- CAMERA
- (near TP40) FLEXCOM10_RX
- F7:PC7 8
- F9:PC18 19
- Project:
- Sub-system:
- Design by:
- Sheet title:
- Sheet
- of
- Checked by:
- Approved by:
- Revision:
- Document No:
- Size:
- Date:
- A3

### Library data of the parts
C299 C300 = _CAP_C_2: CAP
R275 R308 R309 R355-R358 R360-R365 R367 R368 R370 R371 R373 R375 R377-R388 R390 R392 R395 R456 R459 R485 R487 R508-R515 R517-R523 R525 R527-R529 R531-R538 R578-R601 R603 R653 R?#1-R?#3 = _RES_B_2: RES
TP34-TP40 = Test Point: Solder: NF
U29 = SAMA7G54: SAMA7G54 MPU 1000MHz Cortex-A7 TFBGA-343; Manufacturer Part Number 1: SAMA7G54-V/4HB; Manufacturer 1: Microchip; Description_: MCHP MPU 32-BIT Cortex-A7 1000MHz 128kB SAMA7G54-V/4HB TFBGA-343; Populated: YES; MCHP-ID: MIC8923; Symbol: SAMA7G54 TFBGA-343; Dev Tools Status: Design; Owner: Ciprian Abramov; Package: TFBGA-343; Value: SAMA7G54; Type: 32-Bit MPU; Status: MCL Design; Revision: 1; Category: MCHP-Microcontroller; ComponentLink1Description: SVN Datasheet; ComponentLink2Description: Local Datasheet; ComponentLink3URL: C:\ALTIUM_WORK\00001_MCHP-CDB\Library\LibraryRefs\SAMA7G54 TFBGA-343.SchLib; ComponentLink3Description: Open Symbol; ComponentLink4URL: C:\ALTIUM_WORK\00001_MCHP-CDB\Library\Footprints\TFBGA-343_14x14.PcbLib; ComponentLink4Description: Open Footprint; ComponentLink5Description: Open Footprint 2; ComponentLink6Description: Open Footprint 3; ComponentLink7Description: Open Footprint 4; Supplier 1: Microchip; Supplier Part Number 1: SAMA7G54-V/4HB; Quantity Override: 1

## Sheet 08_SAMA7G54-DDR3.SchDoc
size 420 x 297 mm; SheetNumber: 16; SheetTotal: 36
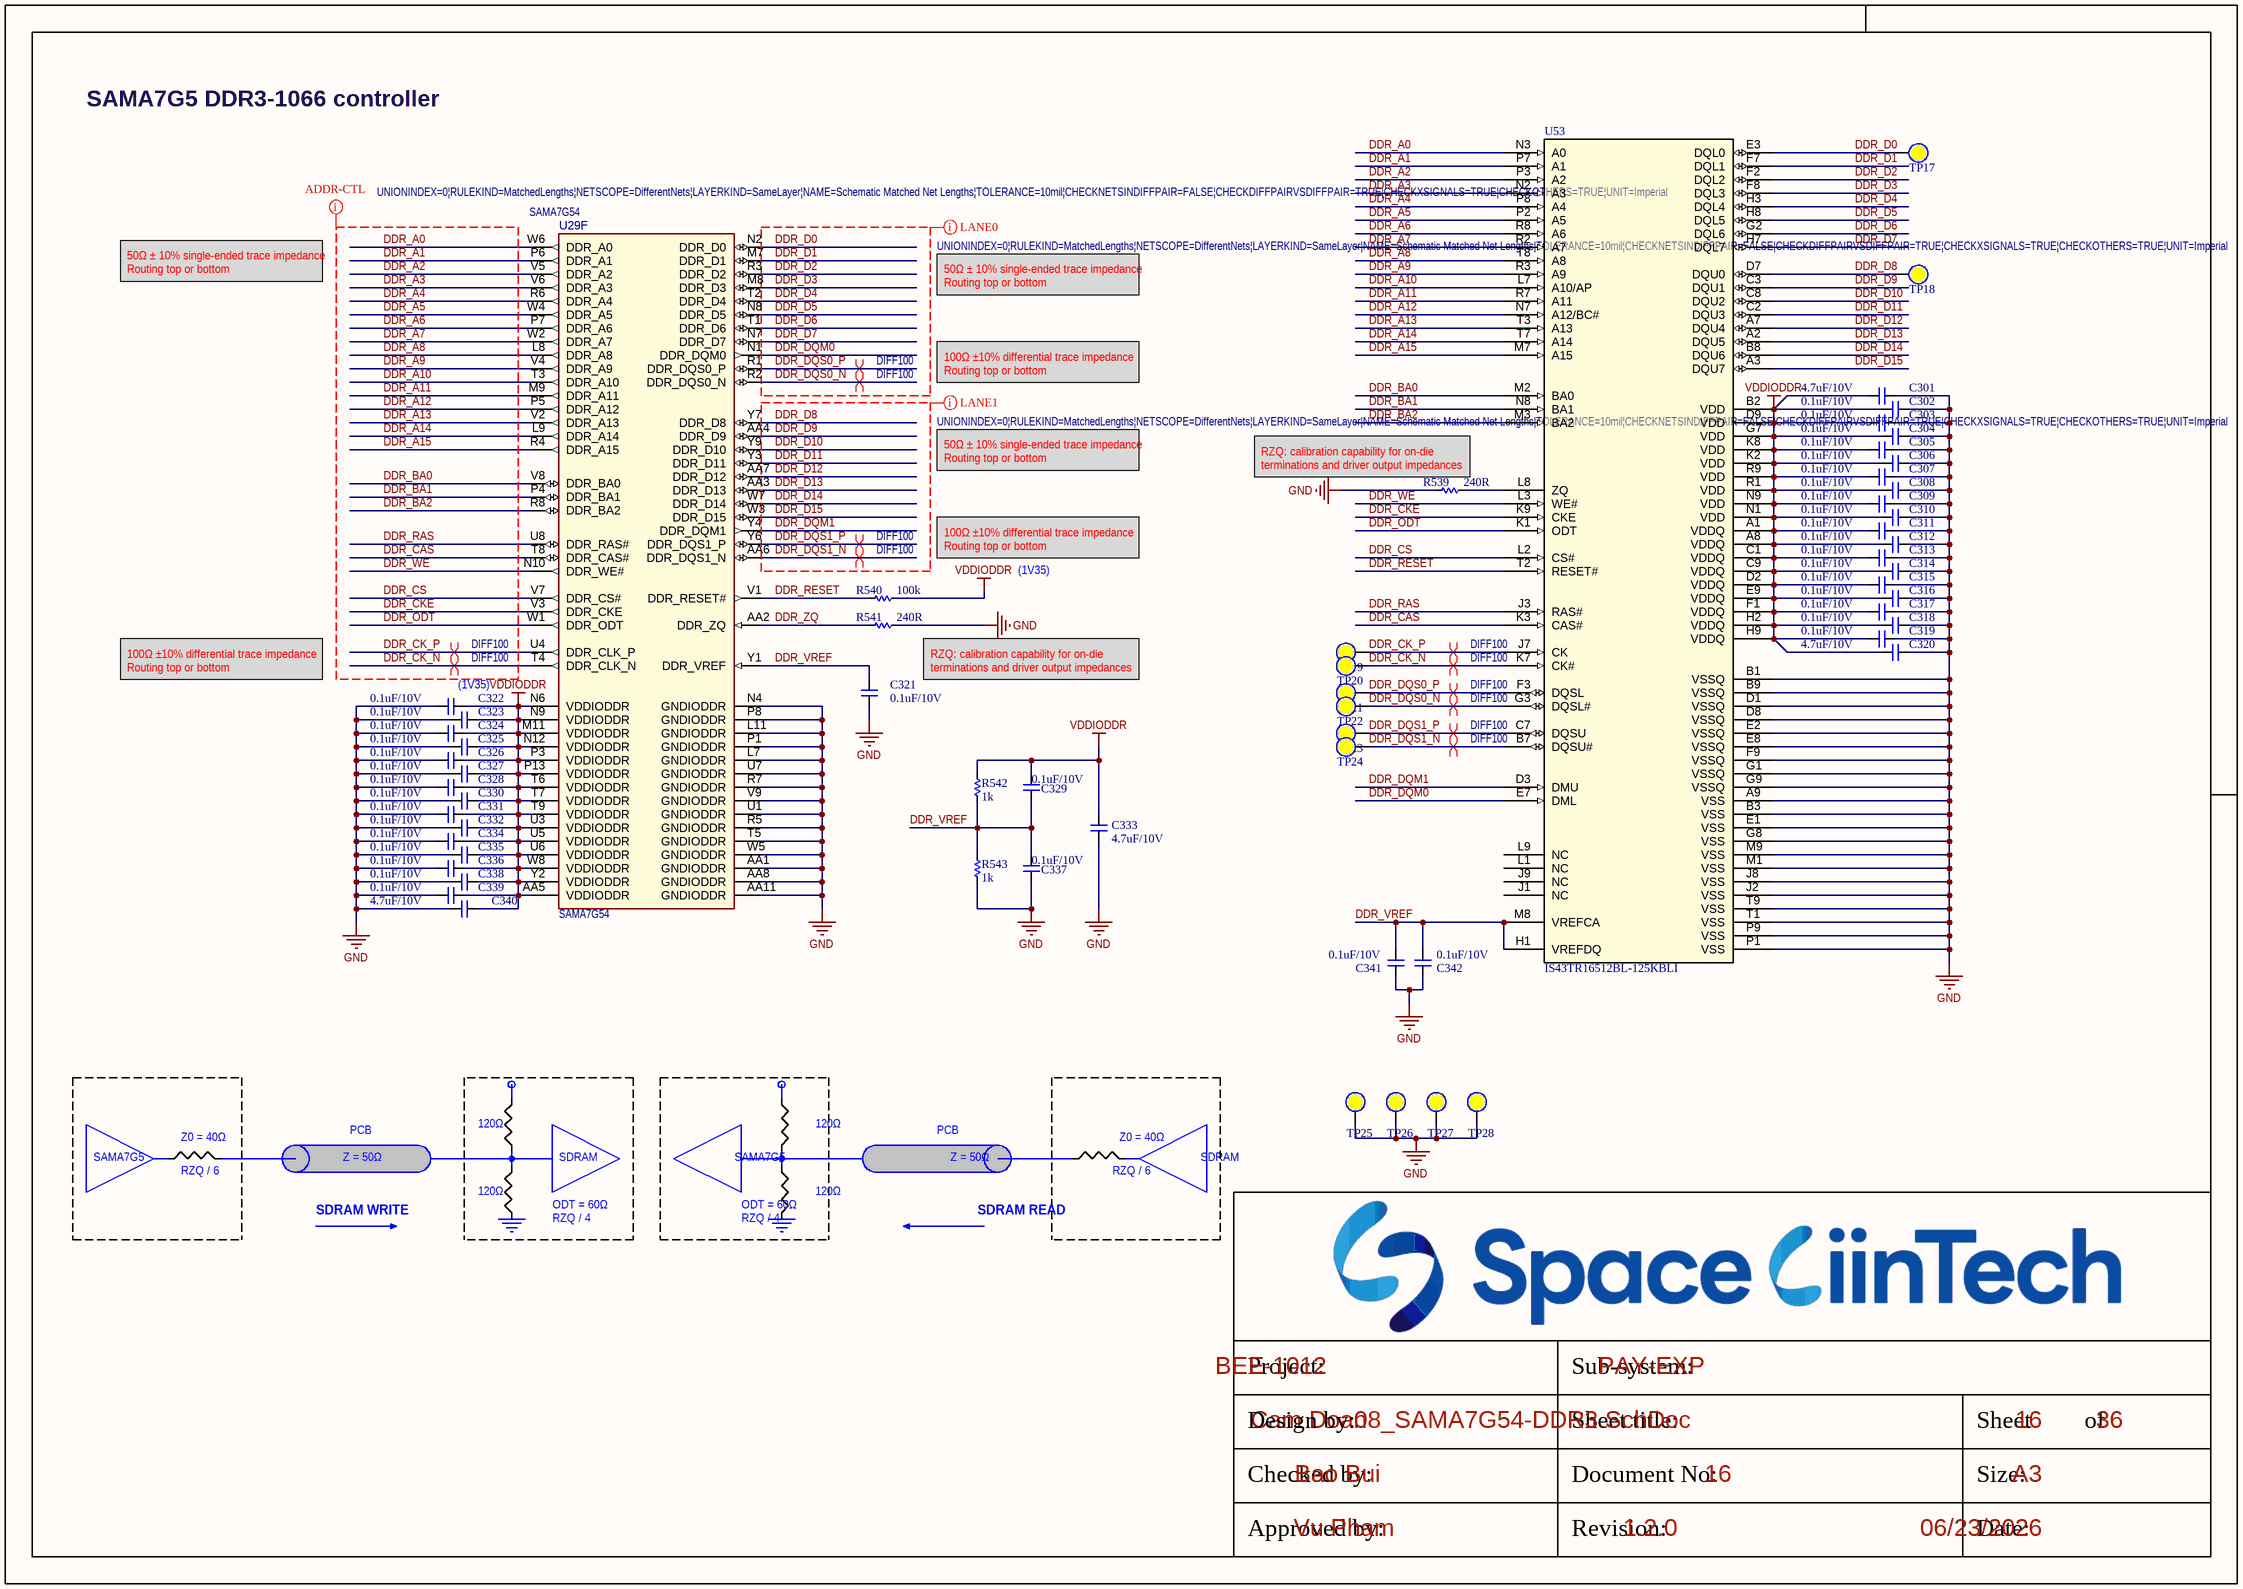
[diagram p14: 08_SAMA7G54-DDR3.SchDoc]

### Parts
C301  4.7uF/10V  [CAP_C_1005X50_L]
C302  0.1uF/10V  [CAP_C_0603x30]
C303  0.1uF/10V  [CAP_C_0603x30]
C304  0.1uF/10V  [CAP_C_0603x30]
C305  0.1uF/10V  [CAP_C_0603x30]
C306  0.1uF/10V  [CAP_C_0603x30]
C307  0.1uF/10V  [CAP_C_0603x30]
C308  0.1uF/10V  [CAP_C_0603x30]
C309  0.1uF/10V  [CAP_C_0603x30]
C310  0.1uF/10V  [CAP_C_0603x30]
C311  0.1uF/10V  [CAP_C_0603x30]
C312  0.1uF/10V  [CAP_C_0603x30]
C313  0.1uF/10V  [CAP_C_0603x30]
C314  0.1uF/10V  [CAP_C_0603x30]
C315  0.1uF/10V  [CAP_C_0603x30]
C316  0.1uF/10V  [CAP_C_0603x30]
C317  0.1uF/10V  [CAP_C_0603x30]
C318  0.1uF/10V  [CAP_C_0603x30]
C319  0.1uF/10V  [CAP_C_0603x30]
C320  4.7uF/10V  [CAP_C_1005X50_L]
C321  0.1uF/10V  [CAP_C_0603x30]
C322  0.1uF/10V  [CAP_C_0603x30]
C323  0.1uF/10V  [CAP_C_0603x30]
C324  0.1uF/10V  [CAP_C_0603x30]
C325  0.1uF/10V  [CAP_C_0603x30]
C326  0.1uF/10V  [CAP_C_0603x30]
C327  0.1uF/10V  [CAP_C_0603x30]
C328  0.1uF/10V  [CAP_C_0603x30]
C329  0.1uF/10V  [CAP_C_0603x30]
C330  0.1uF/10V  [CAP_C_0603x30]
C331  0.1uF/10V  [CAP_C_0603x30]
C332  0.1uF/10V  [CAP_C_0603x30]
C333  4.7uF/10V  [CAP_C_1005X50_L]
C334  0.1uF/10V  [CAP_C_0603x30]
C335  0.1uF/10V  [CAP_C_0603x30]
C336  0.1uF/10V  [CAP_C_0603x30]
C337  0.1uF/10V  [CAP_C_0603x30]
C338  0.1uF/10V  [CAP_C_0603x30]
C339  0.1uF/10V  [CAP_C_0603x30]
C340  4.7uF/10V  [CAP_C_1005X50_L]
C341  0.1uF/10V  [CAP_C_0603x30]
C342  0.1uF/10V  [CAP_C_0603x30]
R539  240R  [RES_C_0603X30]
R540  100k  [RES_C_0603X30]
R541  240R  [RES_C_0603X30]
R542  1k  [RES_C_0603X30]
R543  1k  [RES_C_0603X30]
TP17  (no value)  [Testpoint_80]  (no BOM)
TP18  (no value)  [Testpoint_80]  (no BOM)
TP19  (no value)  [Testpoint_80]  (no BOM)
TP20  (no value)  [Testpoint_80]  (no BOM)
TP21  (no value)  [Testpoint_80]  (no BOM)
TP22  (no value)  [Testpoint_80]  (no BOM)
TP23  (no value)  [Testpoint_80]  (no BOM)
TP24  (no value)  [Testpoint_80]  (no BOM)
TP25  (no value)  [Testpoint_80]  (no BOM)
TP26  (no value)  [Testpoint_80]  (no BOM)
TP27  (no value)  [Testpoint_80]  (no BOM)
TP28  (no value)  [Testpoint_80]  (no BOM)
U29  SAMA7G54  [TFBGA-343_14x14 - 2.5mm]  (part F of 8)
U53  IS43TR16512BL-125KBLI  [TWBGA96_ISI]

### Nets
GND: C301.1 C302.1 C303.1 C304.1 C305.1 C306.1 C307.1 C308.1 C309.1 C310.1 C311.1 C312.1 C313.1 C314.1 C315.1 C316.1 C317.1 C318.1 C319.1 C320.1 C321.2 C322.2 C323.2 C324.2 C325.2 C326.2 C327.2 C328.2 C330.2 C331.2 C332.2 C333.2 C334.2 C335.2 C336.2 C337.2 C338.2 C339.2 C340.2 C341.2 C342.2 R539.2 R541.1 R543.2 TP25.1 TP26.1 TP27.1 TP28.1 U29.AA1(GNDIODDR) U29.AA8(GNDIODDR) U29.AA11(GNDIODDR) U29.L7(GNDIODDR) U29.L11(GNDIODDR) U29.N4(GNDIODDR) U29.P1(GNDIODDR) U29.P8(GNDIODDR) U29.R5(GNDIODDR) U29.R7(GNDIODDR) U29.T5(GNDIODDR) U29.U1(GNDIODDR) U29.U7(GNDIODDR) U29.V9(GNDIODDR) U29.W5(GNDIODDR) U53.A9(VSS) U53.B1(VSSQ) U53.B3(VSS) U53.B9(VSSQ) U53.D1(VSSQ) U53.D8(VSSQ) U53.E1(VSS) U53.E2(VSSQ) U53.E8(VSSQ) U53.F9(VSSQ) U53.G1(VSSQ) U53.G8(VSS) U53.G9(VSSQ) U53.J2(VSS) U53.J8(VSS) U53.M1(VSS) U53.M9(VSS) U53.P1(VSS) U53.P9(VSS) U53.T1(VSS) U53.T9(VSS)
VDDIODDR: C301.2 C302.2 C303.2 C304.2 C305.2 C306.2 C307.2 C308.2 C309.2 C310.2 C311.2 C312.2 C313.2 C314.2 C315.2 C316.2 C317.2 C318.2 C319.2 C320.2 C322.1 C323.1 C324.1 C325.1 C326.1 C327.1 C328.1 C329.1 C330.1 C331.1 C332.1 C333.1 C334.1 C335.1 C336.1 C338.1 C339.1 C340.1 R540.1 R542.1 U29.AA5(VDDIODDR) U29.M11(VDDIODDR) U29.N6(VDDIODDR) U29.N9(VDDIODDR) U29.N12(VDDIODDR) U29.P3(VDDIODDR) U29.P13(VDDIODDR) U29.T6(VDDIODDR) U29.T7(VDDIODDR) U29.T9(VDDIODDR) U29.U3(VDDIODDR) U29.U5(VDDIODDR) U29.U6(VDDIODDR) U29.W8(VDDIODDR) U29.Y2(VDDIODDR) U53.A1(VDDQ) U53.A8(VDDQ) U53.B2(VDD) U53.C1(VDDQ) U53.C9(VDDQ) U53.D2(VDDQ) U53.D9(VDD) U53.E9(VDDQ) U53.F1(VDDQ) U53.G7(VDD) U53.H2(VDDQ) U53.H9(VDDQ) U53.K2(VDD) U53.K8(VDD) U53.N1(VDD) U53.N9(VDD) U53.R1(VDD) U53.R9(VDD)
DDR_A0: U29.W6(DDR_A0) U53.N3(A0)
DDR_A1: U29.P6(DDR_A1) U53.P7(A1)
DDR_A2: U29.V5(DDR_A2) U53.P3(A2)
DDR_A3: U29.V6(DDR_A3) U53.N2(A3)
DDR_A4: U29.R6(DDR_A4) U53.P8(A4)
DDR_A5: U29.W4(DDR_A5) U53.P2(A5)
DDR_A6: U29.P7(DDR_A6) U53.R8(A6)
DDR_A7: U29.W2(DDR_A7) U53.R2(A7)
DDR_A8: U29.L8(DDR_A8) U53.T8(A8)
DDR_A9: U29.V4(DDR_A9) U53.R3(A9)
DDR_A10: U29.T3(DDR_A10) U53.L7(A10/AP)
DDR_A11: U29.M9(DDR_A11) U53.R7(A11)
DDR_A12: U29.P5(DDR_A12) U53.N7(A12/BC#)
DDR_A13: U29.V2(DDR_A13) U53.T3(A13)
DDR_A14: U29.L9(DDR_A14) U53.T7(A14)
DDR_A15: U29.R4(DDR_A15) U53.M7(A15)
DDR_BA0: U29.V8(DDR_BA0) U53.M2(BA0)
DDR_BA1: U29.P4(DDR_BA1) U53.N8(BA1)
DDR_BA2: U29.R8(DDR_BA2) U53.M3(BA2)
DDR_CAS: U29.T8(DDR_CAS#) U53.K3(CAS#)
DDR_CK_N: TP20.1 U29.T4(DDR_CLK_N) U53.K7(CK#)
DDR_CK_P: TP19.1 U29.U4(DDR_CLK_P) U53.J7(CK)
DDR_CKE: U29.V3(DDR_CKE) U53.K9(CKE)
DDR_CS: U29.V7(DDR_CS#) U53.L2(CS#)
DDR_D0: TP17.1 U29.N2(DDR_D0) U53.E3(DQL0)
DDR_D1: U29.M7(DDR_D1) U53.F7(DQL1)
DDR_D2: U29.R3(DDR_D2) U53.F2(DQL2)
DDR_D3: U29.M8(DDR_D3) U53.F8(DQL3)
DDR_D4: U29.T2(DDR_D4) U53.H3(DQL4)
DDR_D5: U29.N8(DDR_D5) U53.H8(DQL5)
DDR_D6: U29.T1(DDR_D6) U53.G2(DQL6)
DDR_D7: U29.N7(DDR_D7) U53.H7(DQL7)
DDR_D8: TP18.1 U29.Y7(DDR_D8) U53.D7(DQU0)
DDR_D9: U29.AA4(DDR_D9) U53.C3(DQU1)
DDR_D10: U29.Y9(DDR_D10) U53.C8(DQU2)
DDR_D11: U29.Y3(DDR_D11) U53.C2(DQU3)
DDR_D12: U29.AA7(DDR_D12) U53.A7(DQU4)
DDR_D13: U29.AA3(DDR_D13) U53.A2(DQU5)
DDR_D14: U29.W7(DDR_D14) U53.B8(DQU6)
DDR_D15: U29.W3(DDR_D15) U53.A3(DQU7)
DDR_DQM0: U29.N1(DDR_DQM0) U53.E7(DML)
DDR_DQM1: U29.Y4(DDR_DQM1) U53.D3(DMU)
DDR_DQS0_N: TP22.1 U29.R2(DDR_DQS0_N) U53.G3(DQSL#)
DDR_DQS0_P: TP21.1 U29.R1(DDR_DQS0_P) U53.F3(DQSL)
DDR_DQS1_N: TP24.1 U29.AA6(DDR_DQS1_N) U53.B7(DQSU#)
DDR_DQS1_P: TP23.1 U29.Y6(DDR_DQS1_P) U53.C7(DQSU)
DDR_ODT: U29.W1(DDR_ODT) U53.K1(ODT)
DDR_RAS: U29.U8(DDR_RAS#) U53.J3(RAS#)
DDR_RESET: R540.2 U29.V1(DDR_RESET#) U53.T2(RESET#)
DDR_VREF: C321.1 C329.2 C337.1 C341.1 C342.1 R542.2 R543.1 U29.Y1(DDR_VREF) U53.H1(VREFDQ) U53.M8(VREFCA)
DDR_WE: U29.N10(DDR_WE#) U53.L3(WE#)
DDR_ZQ: R541.2 U29.AA2(DDR_ZQ)
NetR539_1: R539.1 U53.L8(ZQ)

Not connected (* = marked no-connect by the designer): U53 J1(NC) J9(NC) L1(NC) L9(NC)

### Layout directives
net class DDR-LANE0; rule Matched Net Lengths [Tolerance = 10mil]: DDR_D0, DDR_D1, DDR_D2, DDR_D3, DDR_D4, DDR_D5, DDR_D6, DDR_D7, DDR_DQM0, DDR_DQS0_N, DDR_DQS0_P
net class DDR-LANE1; rule Matched Net Lengths [Tolerance = 10mil]: DDR_D8, DDR_D9, DDR_D10, DDR_D11, DDR_D12, DDR_D13, DDR_D14, DDR_D15, DDR_DQM1, DDR_DQS1_N, DDR_DQS1_P
net class DDR-ADDR-CTL; rule Matched Net Lengths [Tolerance = 10mil]: DDR_A0, DDR_A1, DDR_A2, DDR_A3, DDR_A4, DDR_A5, DDR_A6, DDR_A7, DDR_A8, DDR_A9, DDR_A10, DDR_A11, DDR_A12, DDR_A13, DDR_A14, DDR_A15, DDR_BA0, DDR_BA1, DDR_BA2, DDR_CAS, DDR_CK_N, DDR_CK_P, DDR_CKE, DDR_CS, DDR_ODT, DDR_RAS, DDR_WE
differential pair; differential pair class DIFF100; net class DIFF100; rule Matched Net Lengths [Tolerance = 4mil]: DDR_CK_N, DDR_CK_P, DDR_DQS0_N, DDR_DQS0_P, DDR_DQS1_N, DDR_DQS1_P

### Notes on the sheet
- SAMA7G5 DDR3-1066 controller
- 50Ω ± 10% single-ended trace impedance
  Routing top or bottom
- 100Ω ±10% differential trace impedance
  Routing top or bottom
- (near R539) RZQ: calibration capability for on-die terminations and driver output impedances
- (1V35)
- (near C322) (1V35)
- RZQ: calibration capability for on-die terminations and driver output impedances
- PCB
- 120Ω
- SAMA7G5
- Z0 = 40Ω
- RZQ / 6
- Z = 50Ω
- ODT = 60Ω
- SDRAM
- SDRAM WRITE
- RZQ / 4
- SDRAM READ
- Project:
- Sub-system:
- Design by:
- Sheet title:
- Sheet
- of
- Checked by:
- Approved by:
- Revision:
- Document No:
- Size:
- Date:
- A3

### Library data of the parts
C301-C342 = _CAP_C_2: CAP
R539-R543 = _RES_B_2: RES
TP17-TP28 = Test Point: Solder: NF
U29 = SAMA7G54: as U29 on sheet 08_SAMA7G54-PIO; Package: TFBGA-343; Value: SAMA7G54; Type: 32-Bit MPU; Status: MCL Design; Revision: 1; Category: MCHP-Microcontroller; ComponentLink1Description: SVN Datasheet; ComponentLink2Description: Local Datasheet; ComponentLink3URL: C:\ALTIUM_WORK\00001_MCHP-CDB\Library\LibraryRefs\SAMA7G54 TFBGA-343.SchLib; ComponentLink3Description: Open Symbol; ComponentLink4URL: C:\ALTIUM_WORK\00001_MCHP-CDB\Library\Footprints\TFBGA-343_14x14.PcbLib; ComponentLink4Description: Open Footprint; ComponentLink5Description: Open Footprint 2; ComponentLink6Description: Open Footprint 3; ComponentLink7Description: Open Footprint 4; Supplier 1: Microchip; Supplier Part Number 1: SAMA7G54-V/4HB; Quantity Override: 1
U53 = IC_RAM_IS43TR16512BL-125KBLI: DDR3L; Manufacturer_Name: ISSI; Copyright: Copyright (C) 2025 Ultra Librarian. All rights reserved.; Manufacturer_Part_Number: IS43TR16512BL-125KBLI; RefDes: RefDes; Type: Type

## Sheet 08_SOM_USB_CARD.SchDoc
size 420 x 297 mm; SheetNumber: 17; SheetTotal: 36
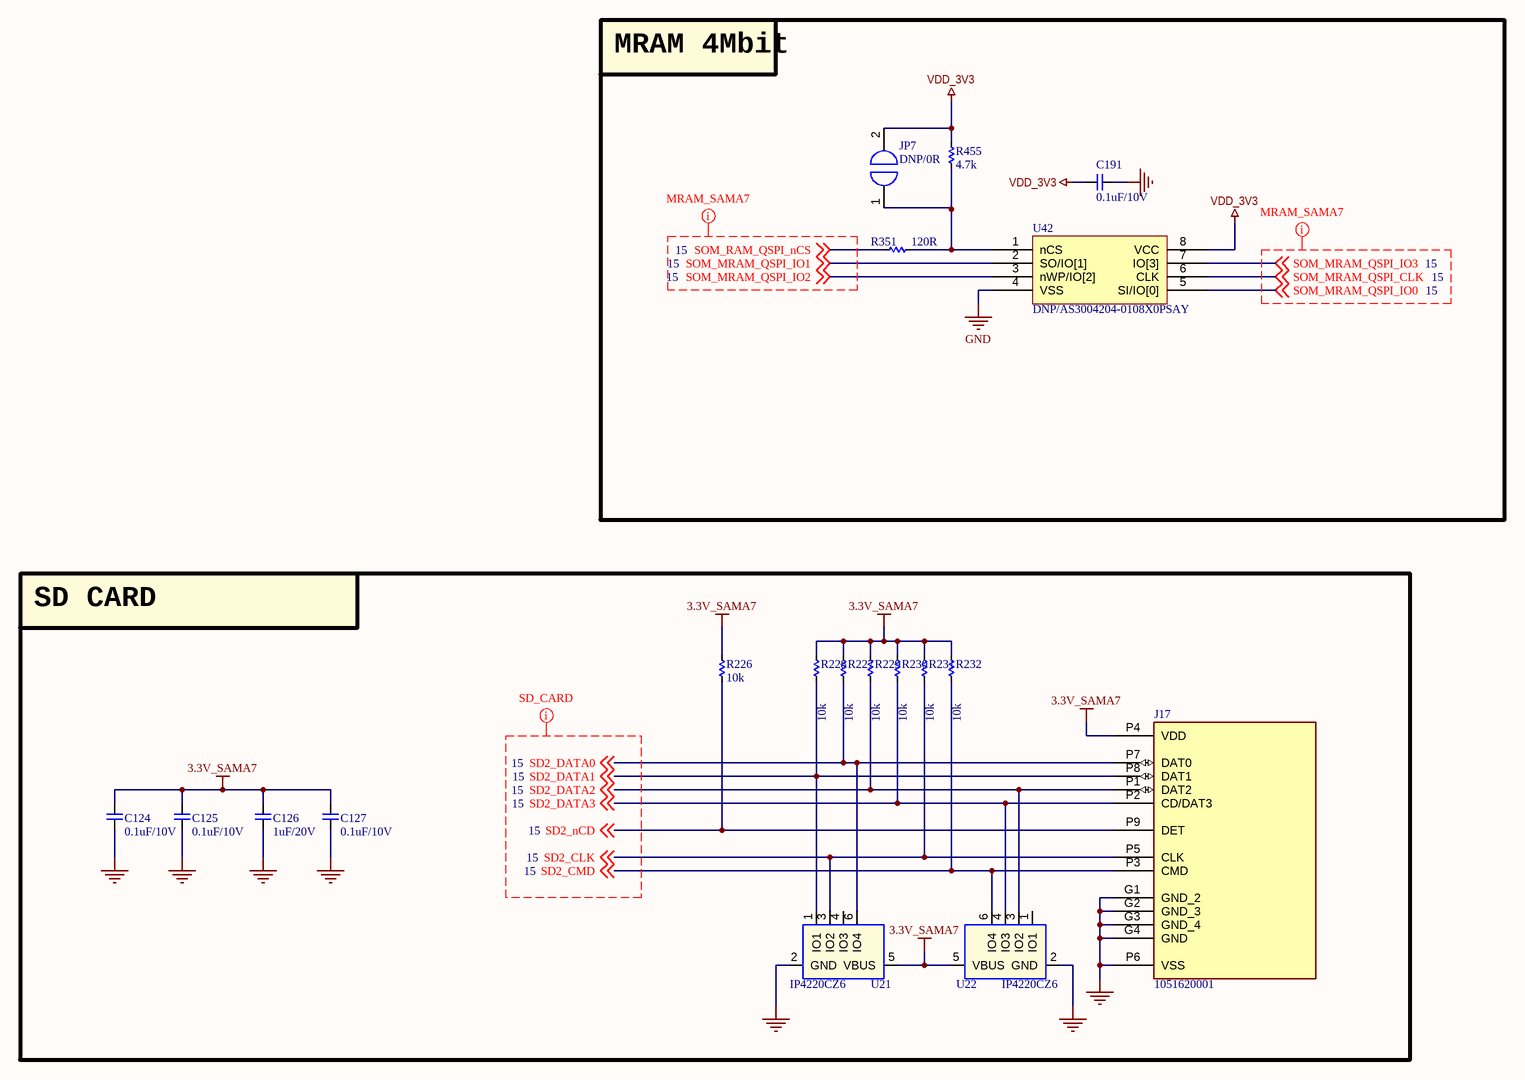
[diagram p15: 08_SOM_USB_CARD.SchDoc]

### Parts
C124  0.1uF/10V  [CAP_C_1005X60]
C125  0.1uF/10V  [CAP_C_1005X60]
C126  1uF/20V  [CAP_C_1005X60]
C127  0.1uF/10V  [CAP_C_1005X60]
C191  0.1uF/10V  [CAP_C_1005X60]
J17  1051620001  [Molex_1051620001]
JP7  DNP/0R  [JUMPER_1608]
R226  10k  [RES_C_1005X40]
R227  10k  [RES_C_1005X40]
R228  10k  [RES_C_1005X40]
R229  10k  [RES_C_1005X40]
R230  10k  [RES_C_1005X40]
R231  10k  [RES_C_1005X40]
R232  10k  [RES_C_1005X40]
R351  120R  [RES_C_1005X40]
R455  4.7k  [RES_C_1005X40]
U21  IP4220CZ6  [SOT95P280X145-6N]
U22  IP4220CZ6  [SOT95P280X145-6N]
U42  DNP/AS3004204-0108X0PSAY  [SOIC127P790X216-8]

### Blocks framed on the sheet
MRAM 4Mbit: C191 JP7 R351 R455 U42
SD CARD: C124-C127 J17 R226-R232 U21 U22

### Nets
3.3V_SAMA7: C124.2 C125.2 C126.2 C127.2 J17.P4(VDD) R226.2 R227.2 R228.2 R229.2 R230.2 R231.2 R232.2 U21.5(VBUS) U22.5(VBUS)
GND: C124.1 C125.1 C126.1 C127.1 C191.1 J17.G1(GND_2) J17.G2(GND_3) J17.G3(GND_4) J17.G4(GND) J17.P6(VSS) U21.2(GND) U22.2(GND) U42.4(VSS)
VDD_3V3: C191.2 JP7.2 R455.2 U42.8(VCC)
SD2_CLK: J17.P5(CLK) R231.1 U21.3(IO2) ; off-sheet SD2_CLK
SD2_CMD: J17.P3(CMD) R232.1 U22.6(IO4) ; off-sheet SD2_CMD
SD2_DATA0: J17.P7(DAT0) R227.1 U21.6(IO4) ; off-sheet SD2_DATA0
SD2_DATA1: J17.P8(DAT1) R228.1 U21.1(IO1) ; off-sheet SD2_DATA1
SD2_DATA2: J17.P1(DAT2) R229.1 U22.3(IO2) ; off-sheet SD2_DATA2
SD2_DATA3: J17.P2(CD/DAT3) R230.1 U22.4(IO3) ; off-sheet SD2_DATA3
SD2_nCD: J17.P9(DET) R226.1 ; off-sheet SD2_nCD
SOM_MRAM_QSPI_CLK: U42.6(CLK) ; off-sheet SOM_MRAM_QSPI_CLK
SOM_MRAM_QSPI_IO0: U42.5(SI/IO[0]) ; off-sheet SOM_MRAM_QSPI_IO0
SOM_MRAM_QSPI_IO1: U42.2(SO/IO[1]) ; off-sheet SOM_MRAM_QSPI_IO1
SOM_MRAM_QSPI_IO2: U42.3(nWP/IO[2]) ; off-sheet SOM_MRAM_QSPI_IO2
SOM_MRAM_QSPI_IO3: U42.7(IO[3]) ; off-sheet SOM_MRAM_QSPI_IO3
SOM_RAM_QSPI_nCS: R351.2 ; off-sheet SOM_RAM_QSPI_nCS
NetJP7_1: JP7.1 R351.1 R455.1 U42.1(nCS)

Not connected (* = marked no-connect by the designer): U21 4(IO3); U22 1(IO1)

### Layout directives
net class MRAM_SAMA7: SOM_MRAM_QSPI_CLK, SOM_MRAM_QSPI_IO0, SOM_MRAM_QSPI_IO1, SOM_MRAM_QSPI_IO2, SOM_MRAM_QSPI_IO3, SOM_RAM_QSPI_nCS
net class SD_CARD: SD2_CLK, SD2_CMD, SD2_DATA0, SD2_DATA1, SD2_DATA2, SD2_DATA3, SD2_nCD

### Notes on the sheet
- Project:
- Sub-system:
- Design by:
- Sheet title:
- Sheet
- of
- Checked by:
- Approved by:
- Revision:
- Document No:
- Size:
- Date:
- A3

### Library data of the parts
C124-C127 C191 = _CAP_C_2: CAP
J17 = Molex_1051620001: 9 (8 + 1) Position Card Connector Secure Digital - microSDâ„¢ Surface Mount, Right Angle Gold; MF: Molex; SnapEDA_Link: https://www.snapeda.com/parts/1051620001/Molex/view-part/?ref=snap; Package: None; Value: *; MP: 1051620001; Check_prices: https://www.snapeda.com/parts/1051620001/Molex/view-part/?ref=eda
JP7 = JUMPER
R226-R232 R351 R455 = _RES_B_2: RES
U21 U22 = IP4220CZ6_0: P/N: 132D42200S; PCB Footprint: SOT23-6L; CLABCONF0: =SB-UCMIMX93
U42 = IC_RAM_AS3004204-0108X0PSAY

## Sheet 09_eMMC.SchDoc
size 420 x 297 mm; SheetNumber: 18; SheetTotal: 36
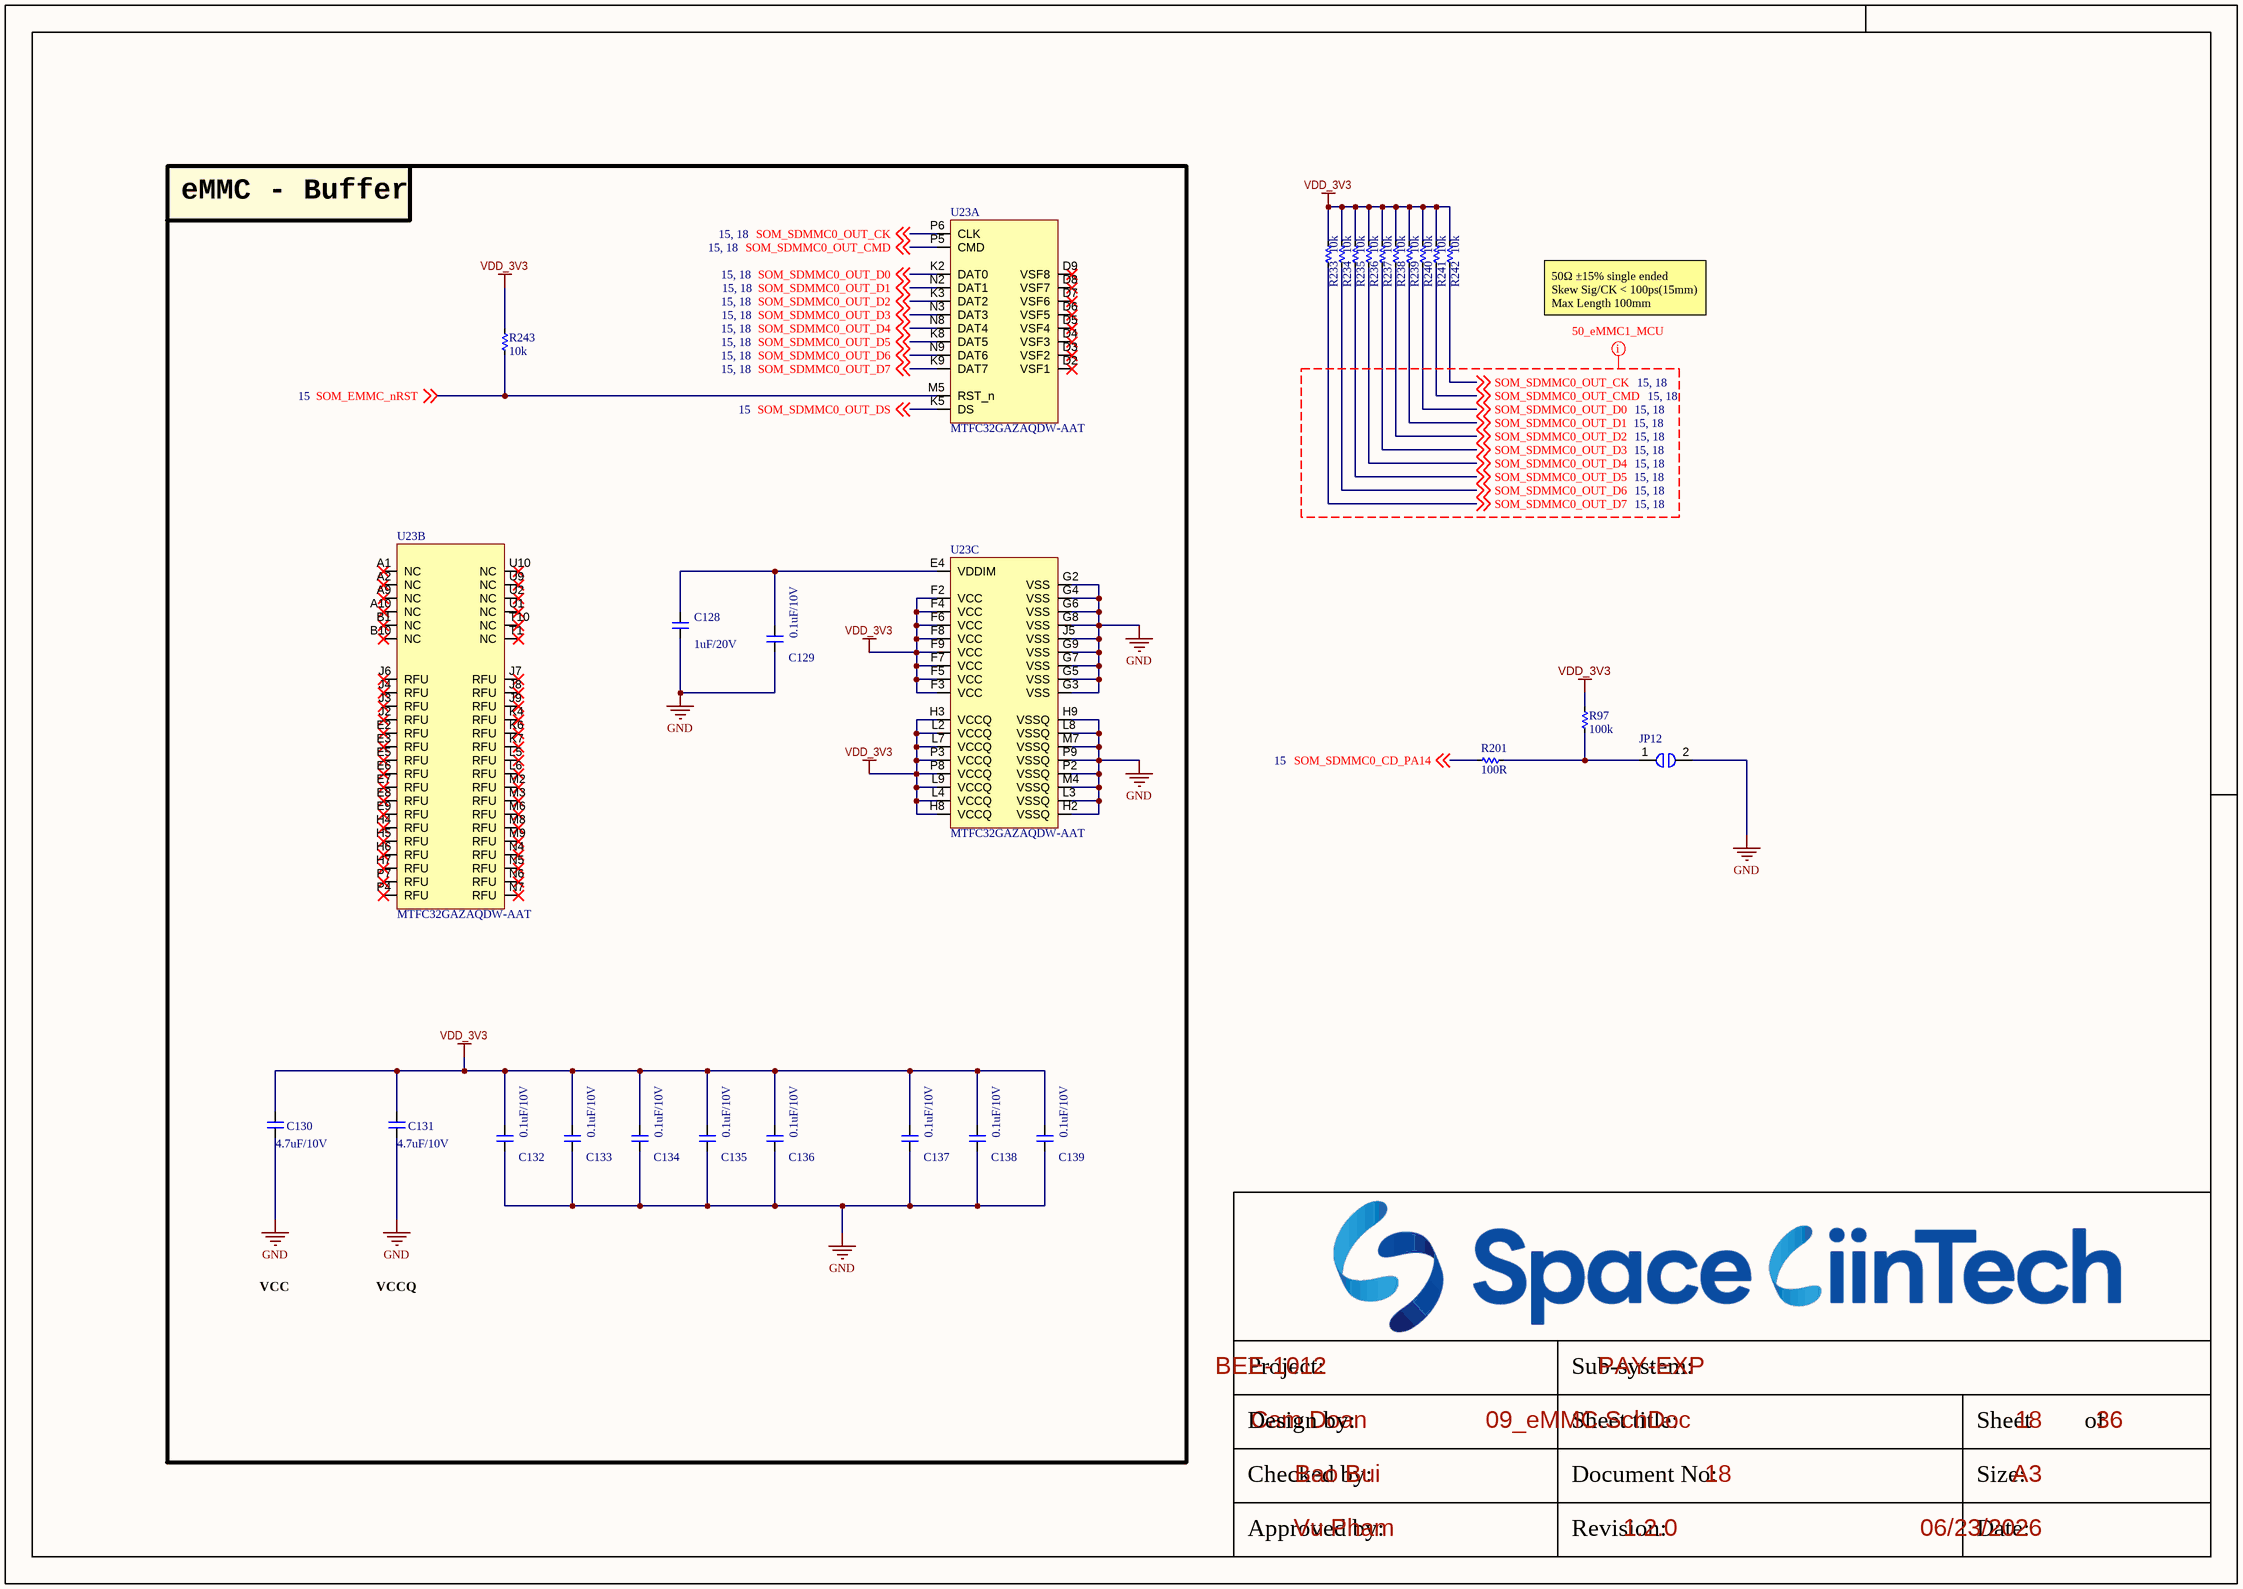
[diagram p16: 09_eMMC.SchDoc]

### Parts
C128  1uF/20V  [CAP_C_1005X60]
C129  0.1uF/10V  [CAP_C_1005X60]
C130  4.7uF/10V  [CAP_C_1005X60]
C131  4.7uF/10V  [CAP_C_1005X60]
C132  0.1uF/10V  [CAP_C_1005X60]
C133  0.1uF/10V  [CAP_C_1005X60]
C134  0.1uF/10V  [CAP_C_1005X60]
C135  0.1uF/10V  [CAP_C_1005X60]
C136  0.1uF/10V  [CAP_C_1005X60]
C137  0.1uF/10V  [CAP_C_1005X60]
C138  0.1uF/10V  [CAP_C_1005X60]
C139  0.1uF/10V  [CAP_C_1005X60]
JP12  (no value)  [TESTPOINT_SHORT_120X100_60]
R97  100k  [RES_C_1005X40]
R201  100R  [RES_C_1005X40]
R233  10k  [RES_C_1005X40]
R234  10k  [RES_C_1005X40]
R235  10k  [RES_C_1005X40]
R236  10k  [RES_C_1005X40]
R237  10k  [RES_C_1005X40]
R238  10k  [RES_C_1005X40]
R239  10k  [RES_C_1005X40]
R240  10k  [RES_C_1005X40]
R241  10k  [RES_C_1005X40]
R242  10k  [RES_C_1005X40]
R243  10k  [RES_C_1005X40]
U23  MTFC32GAZAQDW-AAT  [BGA_100_C_100P_10X17_1400X1800X150]  (parts A,B,C of 3)

### Blocks framed on the sheet
eMMC - Buffer: C128-C139 R243 U23

### Nets
GND: C128.1 C129.1 C130.1 C131.1 C132.1 C133.1 C134.1 C135.1 C136.1 C137.1 C138.1 C139.1 JP12.2 U23.G2(VSS) U23.G3(VSS) U23.G4(VSS) U23.G5(VSS) U23.G6(VSS) U23.G7(VSS) U23.G8(VSS) U23.G9(VSS) U23.H2(VSSQ) U23.H9(VSSQ) U23.J5(VSS) U23.L3(VSSQ) U23.L8(VSSQ) U23.M4(VSSQ) U23.M7(VSSQ) U23.P2(VSSQ) U23.P9(VSSQ)
VDD_3V3: C130.2 C131.2 C132.2 C133.2 C134.2 C135.2 C136.2 C137.2 C138.2 C139.2 R97.2 R233.2 R234.2 R235.2 R236.2 R237.2 R238.2 R239.2 R240.2 R241.2 R242.2 R243.2 U23.F2(VCC) U23.F3(VCC) U23.F4(VCC) U23.F5(VCC) U23.F6(VCC) U23.F7(VCC) U23.F8(VCC) U23.F9(VCC) U23.H3(VCCQ) U23.H8(VCCQ) U23.L2(VCCQ) U23.L4(VCCQ) U23.L7(VCCQ) U23.L9(VCCQ) U23.P3(VCCQ) U23.P8(VCCQ)
SOM_EMMC_nRST: R243.1 U23.M5(RST_n) ; off-sheet SOM_EMMC_nRST
SOM_SDMMC0_CD_PA14: R201.1 ; off-sheet SOM_SDMMC0_CD_PA14
SOM_SDMMC0_OUT_CK: R242.1 U23.P6(CLK) ; off-sheet SOM_SDMMC0_OUT_CK
SOM_SDMMC0_OUT_CMD: R241.1 U23.P5(CMD) ; off-sheet SOM_SDMMC0_OUT_CMD
SOM_SDMMC0_OUT_D0: R240.1 U23.K2(DAT0) ; off-sheet SOM_SDMMC0_OUT_D0
SOM_SDMMC0_OUT_D1: R239.1 U23.N2(DAT1) ; off-sheet SOM_SDMMC0_OUT_D1
SOM_SDMMC0_OUT_D2: R238.1 U23.K3(DAT2) ; off-sheet SOM_SDMMC0_OUT_D2
SOM_SDMMC0_OUT_D3: R237.1 U23.N3(DAT3) ; off-sheet SOM_SDMMC0_OUT_D3
SOM_SDMMC0_OUT_D4: R236.1 U23.N8(DAT4) ; off-sheet SOM_SDMMC0_OUT_D4
SOM_SDMMC0_OUT_D5: R235.1 U23.K8(DAT5) ; off-sheet SOM_SDMMC0_OUT_D5
SOM_SDMMC0_OUT_D6: R234.1 U23.N9(DAT6) ; off-sheet SOM_SDMMC0_OUT_D6
SOM_SDMMC0_OUT_D7: R233.1 U23.K9(DAT7) ; off-sheet SOM_SDMMC0_OUT_D7
SOM_SDMMC0_OUT_DS: U23.K5(DS) ; off-sheet SOM_SDMMC0_OUT_DS
NetC128_2: C128.2 C129.2 U23.E4(VDDIM)
NetJP12_1: JP12.1 R97.1 R201.2

Not connected (* = marked no-connect by the designer): U23 A1(NC)* A2(NC)* A9(NC)* A10(NC)* B1(NC)* B10(NC)* D2(VSF1)* D3(VSF2)* D4(VSF3)* D5(VSF4)* D6(VSF5)* D7(VSF6)* D8(VSF7)* D9(VSF8)* E2(RFU)* E3(RFU)* E5(RFU)* E6(RFU)* E7(RFU)* E8(RFU)* E9(RFU)* H4(RFU)* H5(RFU)* H6(RFU)* H7(RFU)* J2(RFU)* J3(RFU)* J4(RFU)* J6(RFU)* J7(RFU)* J8(RFU)* J9(RFU)* K4(RFU)* K6(RFU)* K7(RFU)* L5(RFU)* L6(RFU)* M2(RFU)* M3(RFU)* M6(RFU)* M8(RFU)* M9(RFU)* N4(RFU)* N5(RFU)* N6(RFU)* N7(RFU)* P4(RFU)* P7(RFU)* T1(NC)* T10(NC)* U1(NC)* U2(NC)* U9(NC)* U10(NC)*

### Layout directives
net class 50_eMMC1_MCU: SOM_SDMMC0_OUT_CK, SOM_SDMMC0_OUT_CMD, SOM_SDMMC0_OUT_D0, SOM_SDMMC0_OUT_D1, SOM_SDMMC0_OUT_D2, SOM_SDMMC0_OUT_D3, SOM_SDMMC0_OUT_D4, SOM_SDMMC0_OUT_D5, SOM_SDMMC0_OUT_D6, SOM_SDMMC0_OUT_D7

### Notes on the sheet
- 50Ω ±15% single ended
  Skew Sig/CK < 100ps(15mm)
  Max Length 100mm
- VCC
- VCCQ
- Project:
- Sub-system:
- Design by:
- Sheet title:
- Sheet
- of
- Checked by:
- Approved by:
- Revision:
- Document No:
- Size:
- Date:
- A3

### Library data of the parts
C128-C139 = _CAP_C_2: CAP
JP12 = JUMPER_1_1
R97 R201 R233-R243 = _RES_B_2: RES

## Sheet 10_USB.SchDoc
size 420 x 297 mm; SheetNumber: 19; SheetTotal: 36
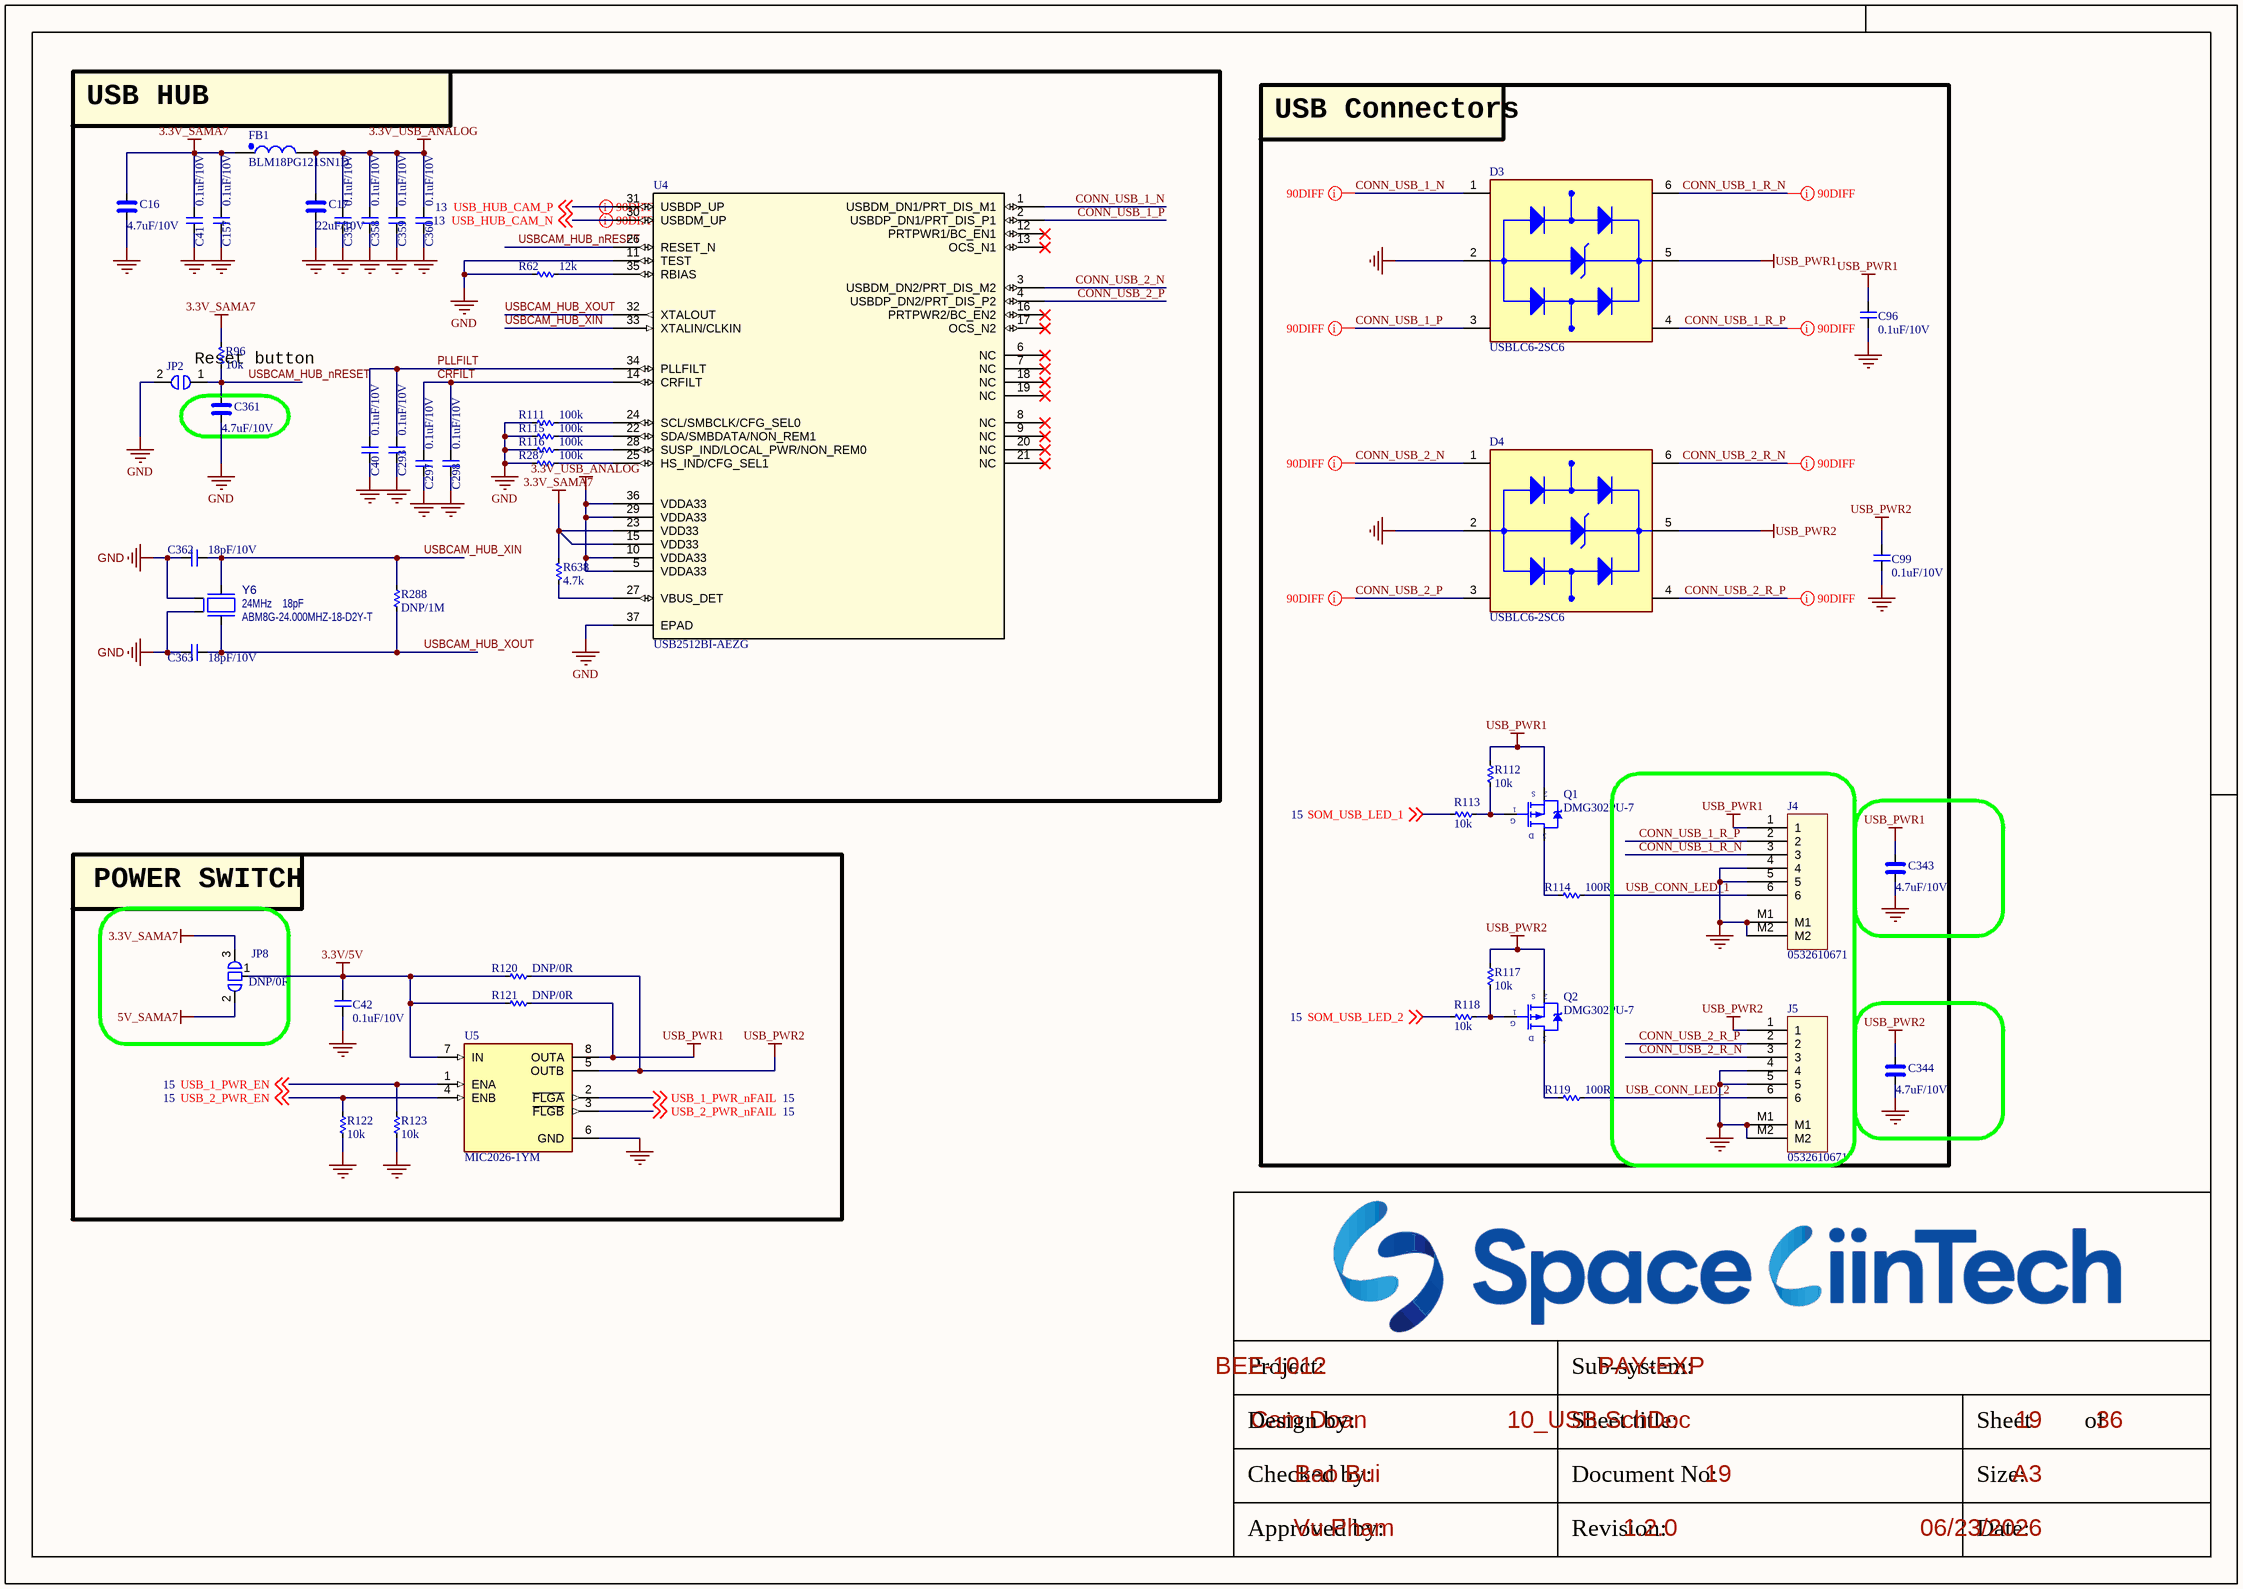
[diagram p17: 10_USB.SchDoc]

### Parts
C16  4.7uF/10V  [CAP_C_1608X80]
C17  22uF/10V  [CAP_C_1608X80]
C40  0.1uF/10V  [CAP_C_1005X60]
C41  0.1uF/10V  [CAP_C_1005X60]
C42  0.1uF/10V  [CAP_C_1005X60]
C96  0.1uF/10V  [CAP_C_1005X60]
C99  0.1uF/10V  [CAP_C_1005X60]
C157  0.1uF/10V  [CAP_C_1005X60]
C293  0.1uF/10V  [CAP_C_1005X60]
C297  0.1uF/10V  [CAP_C_1005X60]
C298  0.1uF/10V  [CAP_C_1005X60]
C343  4.7uF/10V  [CAP_C_1608X80]
C344  4.7uF/10V  [CAP_C_1608X80]
C357  0.1uF/10V  [CAP_C_1005X60]
C358  0.1uF/10V  [CAP_C_1005X60]
C359  0.1uF/10V  [CAP_C_1005X60]
C360  0.1uF/10V  [CAP_C_1005X60]
C361  4.7uF/10V  [CAP_C_1608X80]
C362  18pF/10V  [CAP_C_1005X60]
C363  18pF/10V  [CAP_C_1005X60]
D3  USBLC6-2SC6  [SOT95P280X145-6N]
D4  USBLC6-2SC6  [SOT95P280X145-6N]
FB1  BLM18PG121SN1D  [IND_C_1608X60]
J4  0532610671  [MOLEX_0532610671]
J5  0532610671  [MOLEX_0532610671]
JP2  (no value)  [TESTPOINT_SHORT_120X100_60]
JP8  DNP/0R  [JUMPER_1-2_1608X60]
Q1  DMG302PU-7  [SOT95P240X120-3N]
Q2  DMG302PU-7  [SOT95P240X120-3N]
R62  12k  [RES_C_1005X40]
R96  10k  [RES_C_1005X40]
R111  100k  [RES_C_1005X40]
R112  10k  [RES_C_1005X40]
R113  10k  [RES_C_1005X40]
R114  100R  [RES_C_1005X40]
R115  100k  [RES_C_1005X40]
R116  100k  [RES_C_1005X40]
R117  10k  [RES_C_1005X40]
R118  10k  [RES_C_1005X40]
R119  100R  [RES_C_1005X40]
R120  DNP/0R  [RES_C_1005X40]
R121  DNP/0R  [RES_C_1005X40]
R122  10k  [RES_C_1005X40]
R123  10k  [RES_C_1005X40]
R287  100k  [RES_C_1005X40]
R288  DNP/1M  [RES_C_1005X40]
R638  4.7k  [RES_C_1005X40]
U4  USB2512BI-AEZG  [QFN36_6X6MC_MCH]
U5  MIC2026-1YM  [SOIC127P602X173-8N]
Y6  value 24MHz  Load Capacitance: 18pF  Manufacturer Part Number 1: ABM8G-24.000MHZ-18-D2Y-T  [CRYSTAL_ABM8G]  (hidden comment: Crystal 4 Pins)

### Blocks framed on the sheet
USB HUB: C16 C17 C40 C41 C157 C293 C297 C298 C357-C363 FB1 JP2 R62 R96 R111 R115 R116 R287 R288 R638 U4 Y6
USB Connectors: C96 C99 C343 C344 D3 D4 J4 J5 Q1 Q2 R112-R114 R117-R119
POWER SWITCH: C42 JP8 R120-R123 U5

### Nets
3.3V/5V: C42.2 JP8.1 R120.2 R121.2 U5.7(IN)
3.3V_SAMA7: C16.1 C41.2 C157.2 FB1.1 JP8.3 R96.1 R638.1 U4.15(VDD33) U4.23(VDD33)
3.3V_USB_ANALOG: C17.1 C357.2 C358.2 C359.2 C360.2 FB1.2 U4.5(VDDA33) U4.10(VDDA33) U4.29(VDDA33) U4.36(VDDA33)
5V_SAMA7: JP8.2
GND: C16.2 C17.2 C40.1 C41.1 C42.1 C96.1 C99.1 C157.1 C293.1 C297.1 C298.1 C343.2 C344.2 C357.1 C358.1 C359.1 C360.1 C361.2 C362.2 C363.2 D3.2(GND) D4.2(GND) J4.4 J4.5 J4.M1 J4.M2 J5.4 J5.5 J5.M1 J5.M2 JP2.2 R62.1 R111.1 R115.1 R116.1 R122.2 R123.2 R287.1 U4.11(TEST) U4.37(EPAD) U5.6(GND) Y6.2(GND) Y6.4(GND)
USB_PWR1: C96.2 C343.1 D3.5(VBUS) J4.1 Q1.2(S) R112.1 R121.1 U5.8(OUTA)
USB_PWR2: C99.2 C344.1 D4.5(VBUS) J5.1 Q2.2(S) R117.1 R120.1 U5.5(OUTB)
CONN_USB_1_N: D3.1(I/O1_IN) U4.1(USBDM_DN1/PRT_DIS_M1)
CONN_USB_1_P: D3.3(I/O2_IN) U4.2(USBDP_DN1/PRT_DIS_P1)
CONN_USB_1_R_N: D3.6(I/O1_OUT) J4.3
CONN_USB_1_R_P: D3.4(I/O2_OUT) J4.2
CONN_USB_2_N: D4.1(I/O1_IN) U4.3(USBDM_DN2/PRT_DIS_M2)
CONN_USB_2_P: D4.3(I/O2_IN) U4.4(USBDP_DN2/PRT_DIS_P2)
CONN_USB_2_R_N: D4.6(I/O1_OUT) J5.3
CONN_USB_2_R_P: D4.4(I/O2_OUT) J5.2
CRFILT: C297.2 C298.2 U4.14(CRFILT)
PLLFILT: C40.2 C293.2 U4.34(PLLFILT)
SOM_USB_LED_1: R113.1 ; off-sheet SOM_USB_LED_1
SOM_USB_LED_2: R118.1 ; off-sheet SOM_USB_LED_2
USB_1_PWR_EN: R123.1 U5.1(ENA) ; off-sheet USB_1_PWR_EN
USB_1_PWR_nFAIL: U5.2(~{FLGA}) ; off-sheet USB_1_PWR_nFAIL
USB_2_PWR_EN: R122.1 U5.4(ENB) ; off-sheet USB_2_PWR_EN
USB_2_PWR_nFAIL: U5.3(~{FLGB}) ; off-sheet USB_2_PWR_nFAIL
USB_CONN_LED_1: J4.6 R114.2
USB_CONN_LED_2: J5.6 R119.2
USB_HUB_CAM_N: U4.30(USBDM_UP) ; off-sheet USB_HUB_CAM_N  [project net USBC_N]
USB_HUB_CAM_P: U4.31(USBDP_UP) ; off-sheet USB_HUB_CAM_P  [project net USBC_P]
USBCAM_HUB_nRESET: C361.1 JP2.1 R96.2 U4.26(RESET_N)
USBCAM_HUB_XIN: C362.1 R288.1 U4.33(XTALIN/CLKIN) Y6.3(Osc2)
USBCAM_HUB_XOUT: C363.1 R288.2 U4.32(XTALOUT) Y6.1(Osc1)
NetQ1_1: Q1.1(G) R112.2 R113.2
NetQ1_3: Q1.3(D) R114.1
NetQ2_1: Q2.1(G) R117.2 R118.2
NetQ2_3: Q2.3(D) R119.1
NetR62_2: R62.2 U4.35(RBIAS)
NetR111_2: R111.2 U4.24(SCL/SMBCLK/CFG_SEL0)
NetR115_2: R115.2 U4.22(SDA/SMBDATA/NON_REM1)
NetR116_2: R116.2 U4.28(SUSP_IND/LOCAL_PWR/NON_REM0)
NetR287_2: R287.2 U4.25(HS_IND/CFG_SEL1)
NetR638_2: R638.2 U4.27(VBUS_DET)

Not connected (* = marked no-connect by the designer): U4 6(NC)* 7(NC)* 8(NC)* 9(NC)* 12(PRTPWR1/BC_EN1)* 13(OCS_N1)* 16(PRTPWR2/BC_EN2)* 17(OCS_N2)* 18(NC)* 19(NC)* 20(NC)* 21(NC)*

### Layout directives
differential pair; differential pair class DIFF90: CONN_USB_1_N, CONN_USB_1_P, CONN_USB_1_R_N, CONN_USB_1_R_P, CONN_USB_2_N, CONN_USB_2_P, CONN_USB_2_R_N, CONN_USB_2_R_P, USBC_N, USBC_P

### Notes on the sheet
- (near JP2) Reset button
- Project:
- Sub-system:
- Design by:
- Sheet title:
- Sheet
- of
- Checked by:
- Approved by:
- Revision:
- Document No:
- Size:
- Date:
- A3

### Library data of the parts
C16 C17 C343 C344 C361 = _CAP_C_High_2: CAP CHIP High Value
C40 C41 C157 C293 C297 C298 C357-C360 C362 C363 = _CAP_C_2: CAP CHIP
C42 C96 C99 = _CAP_C_2: CAP
D3 D4 = USBLC6-2SC6: 17V Clamp 5A (8/20Âµs) Ipp Tvs Diode Surface Mount SOT-23-6; MF: STMicroelectronics; Value: *; SnapEDA_Link: https://www.snapeda.com/parts/USBLC6-2SC6/STMicroelectronics/view-part/?ref=snap; Check_prices: https://www.snapeda.com/parts/USBLC6-2SC6/STMicroelectronics/view-part/?ref=eda; Purchase-URL: https://pricing.snapeda.com/search/part/USBLC6-2SC6/?ref=eda; Price: None; Availability: In Stock; Package: SOT-23-6 STMicroelectronics; MP: USBLC6-2SC6
FB1 = _IND
J4 J5 = Header 6x1_2M
JP2 = JUMPER_1_1
JP8 = JUMPER_1_2
Q1 Q2 = MOSFET_P_GSD
R62 R96 R111-R123 R287 R288 R638 = _RES_B_2: RES
U4 = IC_USB_HUB_USB2512BI-AEZG: Description; Manufacturer_Name: Microchip; Copyright: Copyright (C) 2026 Ultra Librarian. All rights reserved.; Manufacturer_Part_Number: USB2512BI-AEZG; RefDes: RefDes; Type: Type
U5 = IC_PWRSW_MIC2026-1YM: Power Switch/Driver 1:2 N-Channel 1.25A 8-SOIC; MF: Microchip; SnapEDA_Link: https://www.snapeda.com/parts/MIC2026-1YM/Microchip/view-part/?ref=snap; Package: SO-8 Microchip; Value: *; MP: MIC2026-1YM; Check_prices: https://www.snapeda.com/parts/MIC2026-1YM/Microchip/view-part/?ref=eda
Y6 = OSC1047: Crystal; Manufacturer 1: Abracon Corporation; Description_: CRYSTAL 24MHz 18pF SMD ABM8G; Dev Tools Status: Production; Owner: Mark Loper; Populated: DNP; MCHP-ID: OSC1047; Revision: 1; Symbol: Crystal 4 Pins; Status: MCL Design; ComponentLink1URL: https://chn-vm-apps.microchip.com/mchprepo/parts/Datasheets/ABM8G.pdf; ComponentLink1Description: SVN Datasheet; ComponentLink2URL: C:\ALTIUM_WORK\00001_MCHP-CDB\Datasheets\ABM8G.pdf; ComponentLink2Description: Local Datasheet; ComponentLink3URL: C:\ALTIUM_WORK\00001_MCHP-CDB\Library\LibraryRefs\Crystal 4 Pins.SchLib; ComponentLink3Description: Open Symbol; ComponentLink4URL: C:\ALTIUM_WORK\00001_MCHP-CDB\Library\Footprints\CRYSTAL_ABM8G.PcbLib; ComponentLink4Description: Open Footprint; ComponentLink5Description: Open Footprint 2; ComponentLink6Description: Open Footprint 3; ComponentLink7Description: Open Footprint 4; Package: ABM8G; Type: Crystal; Category: Crystal/Oscillator; Supplier 1: Digi-Key; Supplier Part Number 1: 535-10273-1-ND; Quantity Override: 1